# Altium project SynTrack.PrjPcb
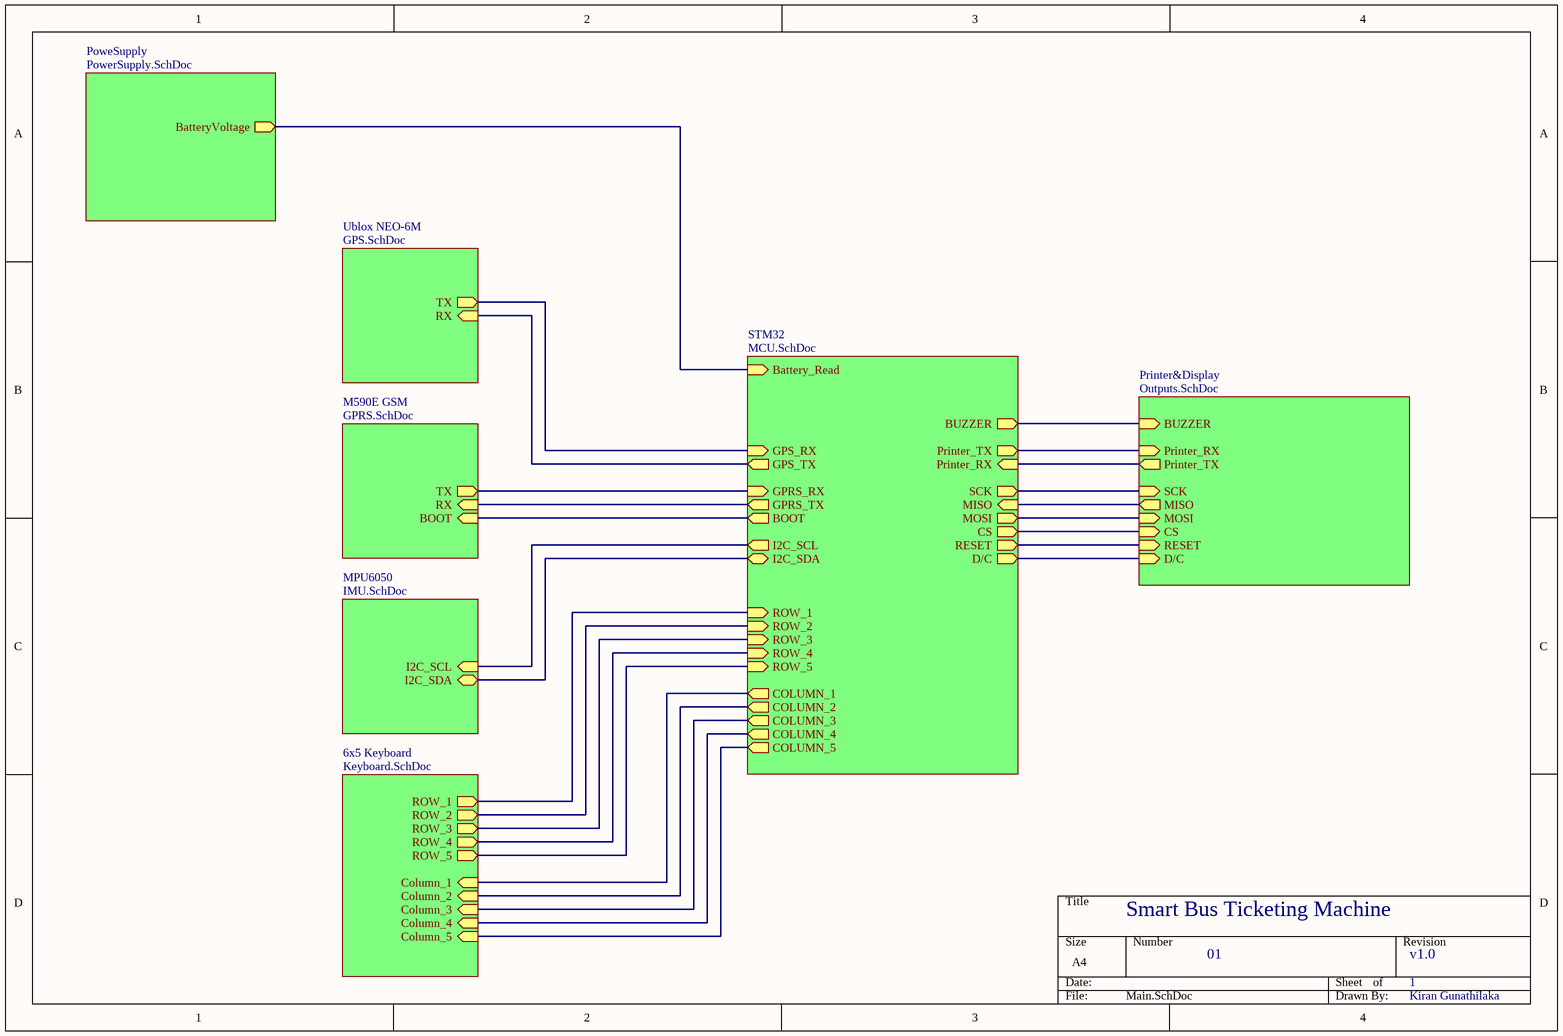
[diagram p0: Main.SchDoc]
11 sheets, 123 parts. Net scope: hierarchical (ports join the sheet entries above them; power ports are global).
Board file: Main.PcbDoc
Sheets:
  Main.SchDoc
    STM32 = MCU.SchDoc
    M590E GSM = GPRS.SchDoc
    MPU6050 = IMU.SchDoc
    6x5 Keyboard = Keyboard.SchDoc
    Ublox NEO-6M = GPS.SchDoc
    PoweSupply = PowerSupply.SchDoc
    Printer&Display = Outputs.SchDoc
      Buzzer = Buzzer.SchDoc
      ThermalPrinter = Printer.SchDoc
      TFT_LCD_2.8" Display = Display.SchDoc

## Sheet Main.SchDoc: Smart Bus Ticketing Machine
size A4; Date: 3/10/2025; ApprovedBy: Kiran Gunathilaka; CheckedBy: Kiran Gunathilaka; Author: Kiran Gunathilaka; DrawnBy: Kiran Gunathilaka; DocumentNumber: 01; Revision: v1.0; SheetNumber: 1; SheetTotal: 11

### Sub-sheets
6x5 Keyboard = Keyboard.SchDoc: ROW_1 (out), ROW_2 (out), ROW_3 (out), ROW_4 (out), ROW_5 (out), Column_1 (in), Column_2 (in), Column_3 (in), Column_4 (in), Column_5 (in)
M590E GSM = GPRS.SchDoc: RX (in), TX (out), BOOT (in)
MPU6050 = IMU.SchDoc: I2C_SCL (in), I2C_SDA (bidir)
PoweSupply = PowerSupply.SchDoc: BatteryVoltage (out)
Printer&Display = Outputs.SchDoc: BUZZER (in), Printer_TX (out), Printer_RX (in), SCK (in), MISO (out), MOSI (in), CS (in), RESET (in), D/C (in)
STM32 = MCU.SchDoc: Printer_TX (out), Printer_RX (in), GPS_RX (in), GPS_TX (out), GPRS_RX (in), GPRS_TX (out), BUZZER (out), Battery_Read (in), ROW_1 (in), ROW_2 (in), ROW_3 (in), ROW_4 (in), ROW_5 (in), SCK (out), MISO (in), MOSI (out), COLUMN_1 (out), COLUMN_2 (out), COLUMN_3 (out), COLUMN_4 (out), COLUMN_5 (out), CS (out), I2C_SCL (out), I2C_SDA (bidir), RESET (out), D/C (out), BOOT (out)
Ublox NEO-6M = GPS.SchDoc: RX (in), TX (out)

### Nets
ADC_OUT: sheet STM32/Battery_Read, sheet PoweSupply/BatteryVoltage
BOOT: sheet STM32/BOOT, sheet M590E GSM/BOOT
Buzzer: sheet STM32/BUZZER, sheet Printer&Display/BUZZER
CS: sheet STM32/CS, sheet Printer&Display/CS
D/C: sheet STM32/RESET, sheet Printer&Display/RESET
GPRS_RX: sheet STM32/GPRS_RX, sheet M590E GSM/TX
GPRS_TX: sheet STM32/GPRS_TX, sheet M590E GSM/RX
GPS_RX: sheet STM32/GPS_RX, sheet Ublox NEO-6M/TX
GPS_TX: sheet STM32/GPS_TX, sheet Ublox NEO-6M/RX
MISO: sheet STM32/MISO, sheet Printer&Display/MISO
MOSI: sheet STM32/MOSI, sheet Printer&Display/MOSI
Printer_RX: sheet STM32/Printer_RX, sheet Printer&Display/Printer_TX
Printer_TX: sheet STM32/Printer_TX, sheet Printer&Display/Printer_RX
RESET: sheet STM32/D/C, sheet Printer&Display/D/C
ROW1: sheet STM32/ROW_1, sheet 6x5 Keyboard/ROW_1
ROW2: sheet STM32/ROW_2, sheet 6x5 Keyboard/ROW_2
ROW3: sheet STM32/ROW_3, sheet 6x5 Keyboard/ROW_3
ROW4: sheet STM32/ROW_4, sheet 6x5 Keyboard/ROW_4
ROW5: sheet STM32/ROW_5, sheet 6x5 Keyboard/ROW_5
SCK: sheet STM32/SCK, sheet Printer&Display/SCK
NetD4_1: sheet STM32/COLUMN_1, sheet 6x5 Keyboard/Column_1
NetD5_1: sheet STM32/COLUMN_2, sheet 6x5 Keyboard/Column_2
NetD6_1: sheet STM32/COLUMN_3, sheet 6x5 Keyboard/Column_3
NetD7_1: sheet STM32/COLUMN_4, sheet 6x5 Keyboard/Column_4
NetD8_1: sheet STM32/COLUMN_5, sheet 6x5 Keyboard/Column_5
NetR8_2: sheet STM32/I2C_SCL, sheet MPU6050/I2C_SCL
NetR9_2: sheet STM32/I2C_SDA, sheet MPU6050/I2C_SDA

## Sheet MCU.SchDoc: Smart Bus Ticketing Machine/MCU
size A4; Date: 3/10/2025; CheckedBy: Kiran Gunathilaka; Author: Kiran Gunathilaka; DrawnBy: Kiran Gunathilaka; DocumentNumber: 02; Revision: v1.1; SheetNumber: 2; SheetTotal: 11
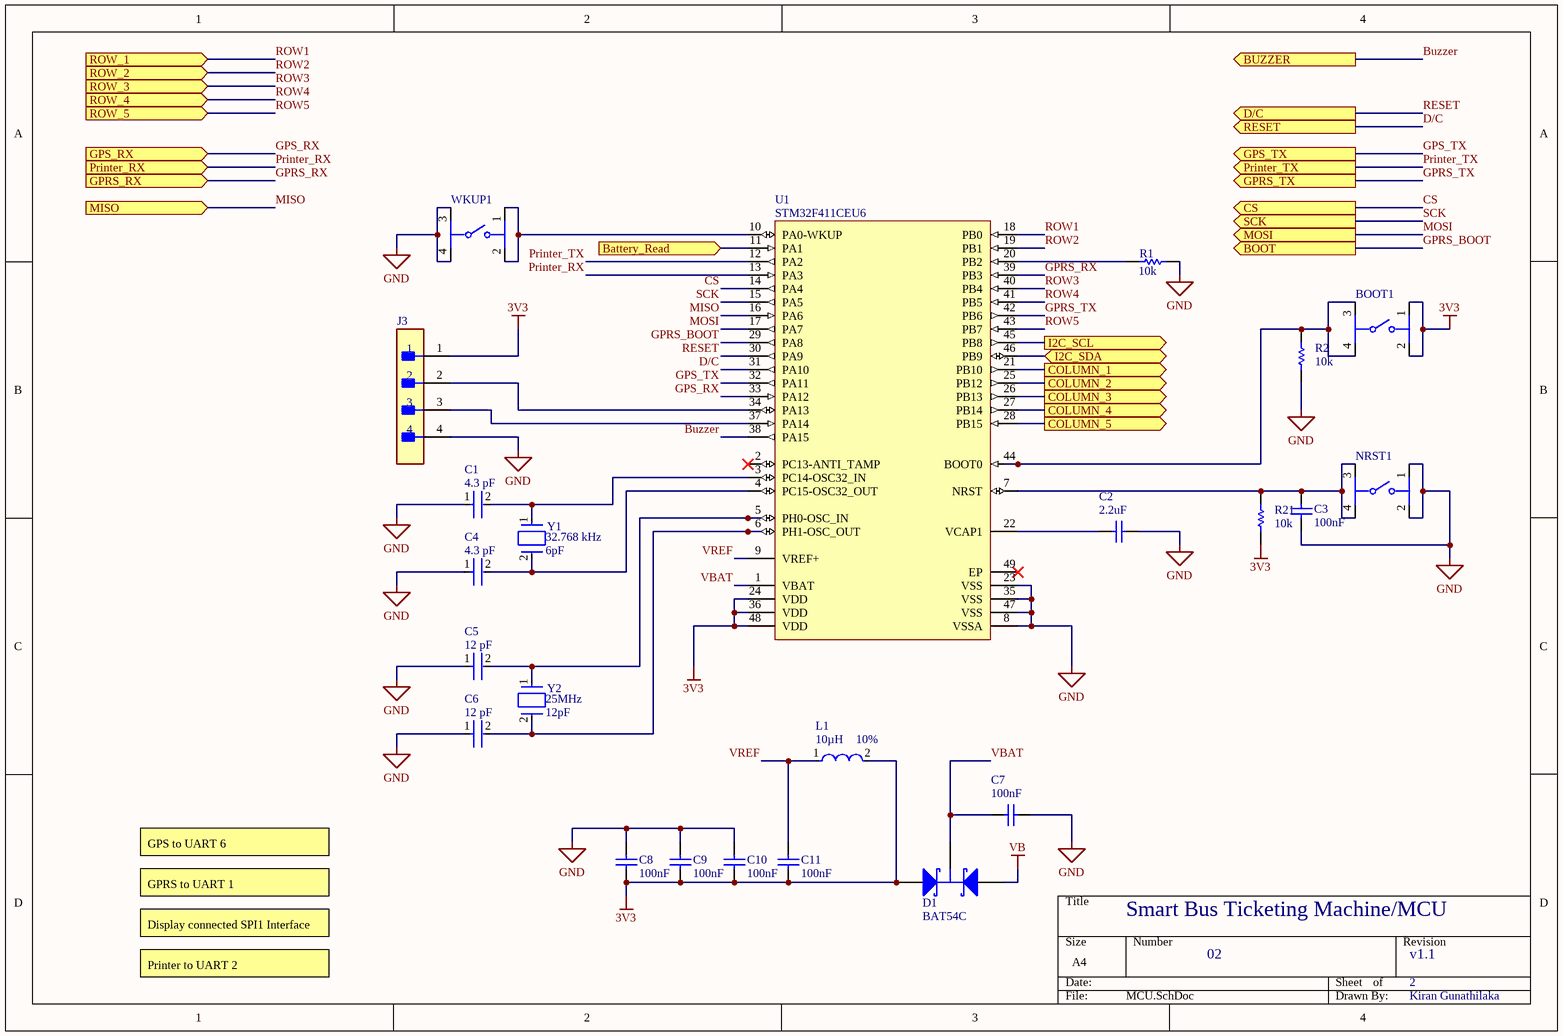
[diagram p1: MCU.SchDoc]

### Parts
BOOT1  PTS645SM43SMTR92LFS  [FP-PTS645SM43SMTR92LFS-MFG]  (value not drawn)
C1  Capacitance: 4.3 pF  [FP-C0805C-DN-MFG]  (hidden comment: C0805C439C5GACTU)
C2  value 2.2uF  [CAPC2013X145X50ML20T25]  (hidden comment: C0805C225K9PACTU)
C3  value 100nF  [CAPC2013X94X50ML20T25]  (hidden comment: 08051C152KAT2A)
C4  Capacitance: 4.3 pF  [FP-C0805C-DN-MFG]  (hidden comment: C0805C439C5GACTU)
C5  Capacitance: 12 pF  [FP-C0805C-DN-MFG]  (hidden comment: C0805C120J5GACTU)
C6  Capacitance: 12 pF  [FP-C0805C-DN-MFG]  (hidden comment: C0805C120J5GACTU)
C7  value 100nF  [CAPC2013X94X50ML20T25]  (hidden comment: 08051C152KAT2A)
C8  value 100nF  [CAPC2013X94X50ML20T25]  (hidden comment: 08051C152KAT2A)
C9  value 100nF  [CAPC2013X94X50ML20T25]  (hidden comment: 08051C152KAT2A)
C10  value 100nF  [CAPC2013X94X50ML20T25]  (hidden comment: 08051C152KAT2A)
C11  value 100nF  [CAPC2013X94X50ML20T25]  (hidden comment: 08051C152KAT2A)
D1  BAT54C  [NXP-SOT23-3_V]
J3  B04B-XASK-1(LF)(SN)  [FP-B04B-XASK-1_LF_SN-MFG]  (value not drawn)
L1  Inductance: 10µH  Tolerance: 10%  [FP-IMC-1210-MFG]  (hidden comment: IMC1210ER100K)
NRST1  PTS645SM43SMTR92LFS  [FP-PTS645SM43SMTR92LFS-MFG]  (value not drawn)
R1  value 10k  [RESC2013X60X35NL10T20]  (hidden comment: RC0805FR-0710KL)
R2  value 10k  [RESC2013X60X35NL10T20]  (hidden comment: RC0805FR-0710KL)
R21  value 10k  [RESC2013X60X35NL10T20]  (hidden comment: RC0805FR-0710KL)
U1  STM32F411CEU6  [STM-UFQFPN48_L]
WKUP1  PTS645SM43SMTR92LFS  [FP-PTS645SM43SMTR92LFS-MFG]  (value not drawn)
Y1  Load Capacitance: 6pF  Operating Frequency: 32.768 kHz  [FP-ABS07-120-MFG]  (hidden comment: ABS07-120-32.768KHZ-T)
Y2  Frequency: 25MHz  Load Capacitance: 12pF  [FP-AA-MFG]  (hidden comment: AA-25.000MALE-T)

### Ports
Battery_Read (in, see Main[2B]), BOOT (out, see Main[2C], GPRS[1A]), BUZZER (out, see Main[3B], Buzzer[2B], Outputs[2B]), COLUMN_1 (out, see Main[2C], Keyboard[1A]), COLUMN_2 (out, see Main[2C], Keyboard[1A]), COLUMN_3 (out, see Main[2C], Keyboard[1A]), COLUMN_4 (out, see Main[2C], Keyboard[1A]), COLUMN_5 (out, see Main[2C], Keyboard[1A]), CS (out, see Main[3C], Display[2C], Outputs[2C]), D/C (out, see Main[3C], Display[2C], Outputs[2D]), GPRS_RX (in, see Main[2B]), GPRS_TX (out, see Main[2B]), GPS_RX (in, see Main[2B]), GPS_TX (out, see Main[2B]), I2C_SCL (out, see Main[2C], IMU[2B]), I2C_SDA (bidir, see Main[2C], IMU[2B]), MISO (in, see Main[3B], Display[3B], Outputs[4C]), MOSI (out, see Main[3C], Display[2C], Outputs[2D]), Printer_RX (in, see Main[3B]), Printer_TX (out, see Main[3B]), RESET (out, see Main[3C], Display[2C], Outputs[2D]), ROW_1 (in, see Main[2C], Keyboard[3B]), ROW_2 (in, see Main[2C], Keyboard[3B]), ROW_3 (in, see Main[2C], Keyboard[3C]), ROW_4 (in, see Main[2C], Keyboard[3C]), ROW_5 (in, see Main[2C], Keyboard[3D]), SCK (out, see Main[3B], Display[2C], Outputs[2C])

### Nets
3V3: BOOT1.1 BOOT1.2 C8.1 C9.1 C10.1 C11.1 D1.1(A) J3.1 L1.2 R21.1 U1.24(VDD) U1.36(VDD) U1.48(VDD)
GND: C1.1 C2.2 C3.1 C4.1 C5.1 C6.1 C7.2 C8.2 C9.2 C10.2 J3.4 NRST1.1 NRST1.2 R1.1 R2.1 U1.8(VSSA) U1.23(VSS) U1.35(VSS) U1.47(VSS) WKUP1.3 WKUP1.4
VB: D1.2(A)
ADC_OUT: U1.11(PA1) ; port Battery_Read
Buzzer: U1.38(PA15) ; port BUZZER
CS: U1.14(PA4) ; port CS
D/C: U1.31(PA10) ; port RESET
GPRS_BOOT: U1.29(PA8) ; port BOOT  [project net BOOT]
GPRS_RX: U1.39(PB3) ; port GPRS_RX
GPRS_TX: U1.42(PB6) ; port GPRS_TX
GPS_RX: U1.33(PA12) ; port GPS_RX
GPS_TX: U1.32(PA11) ; port GPS_TX
MISO: U1.16(PA6) ; port MISO
MOSI: U1.17(PA7) ; port MOSI
Printer_RX: U1.13(PA3) ; port Printer_RX
Printer_TX: U1.12(PA2) ; port Printer_TX
RESET: U1.30(PA9) ; port D/C
ROW1: U1.18(PB0) ; port ROW_1
ROW2: U1.19(PB1) ; port ROW_2
ROW3: U1.40(PB4) ; port ROW_3
ROW4: U1.41(PB5) ; port ROW_4
ROW5: U1.43(PB7) ; port ROW_5
SCK: U1.15(PA5) ; port SCK
VBAT: C7.1 D1.3(K) U1.1(VBAT)
VREF: C11.2 L1.1 U1.9(VREF+)
NetBOOT1_3: BOOT1.3 BOOT1.4 R2.2 U1.44(BOOT0)
NetC1_2: C1.2 U1.3(PC14-OSC32_IN) Y1.1
NetC2_1: C2.1 U1.22(VCAP1)
NetC3_2: C3.2 NRST1.3 NRST1.4 R21.2 U1.7(NRST)
NetC4_2: C4.2 U1.4(PC15-OSC32_OUT) Y1.2
NetC5_2: C5.2 U1.5(PH0-OSC_IN) Y2.1
NetC6_2: C6.2 U1.6(PH1-OSC_OUT) Y2.2
NetD4_1: U1.21(PB10) ; port COLUMN_1
NetD5_1: U1.25(PB12) ; port COLUMN_2
NetD6_1: U1.26(PB13) ; port COLUMN_3
NetD7_1: U1.27(PB14) ; port COLUMN_4
NetD8_1: U1.28(PB15) ; port COLUMN_5
NetJ3_2: J3.2 U1.34(PA13)
NetJ3_3: J3.3 U1.37(PA14)
NetR1_2: R1.2 U1.20(PB2)
NetR8_2: U1.45(PB8) ; port I2C_SCL
NetR9_2: U1.46(PB9) ; port I2C_SDA
NetU1_10: U1.10(PA0-WKUP) WKUP1.1 WKUP1.2

Not connected (* = marked no-connect by the designer): U1 2(PC13-ANTI_TAMP)* 49(EP)*

### Notes on the sheet
- GPS to UART 6
- GPRS to UART 1
- Display connected SPI1 Interface
- Printer to UART 2

### Library data of the parts
BOOT1 NRST1 WKUP1 = CMP-2000-05160-2: SWITCH TACTILE SPST-NO 0.05A 12V; Contact Resistance: 100mR; Throw Configuration: SPST; Illumination Type: Non-Illuminated; Mechanical Life: 100000Cycles; Current Rating: 50mA; Switch Function: Off-Mom; Actuator Length: 0.85mm; Actuator Material: Nylon; Actuator Type: Standard; Operating Force: 160gf; Min Operating Temperature: -20°C; REACH SVHC: No SVHC; Termination: Gull Wing; Case/Package: SMD/SMT; Packaging: Tape and Reel; Mount: Surface Mount; Voltage Rating (DC): 12V; Orientation: Straight; Lead Free: Lead Free; Contact Material: Silver; Color: Black; Max Current Rating: 50mA; Contact Plating: Silver; Depth: 9mm; Package Quantity: 1; Max Voltage Rating (DC): 12V; Length: 6mm; Max Operating Temperature: 60°C
C1 C4 = CMP-03020-016664-1: CAP CER 4.3PF 50V NP0 0805; Manufacturer: KEMET; Tolerance: 0.25 pF; Temperature Characteristic: C0G; Temperature Coefficient: 30ppm/°C; Material: Ceramic; Octopart: https://octopart.com/c0805c439c5gactu-kemet-9144293; Automotive: No; Height: 0.88mm; Device Class L1: Passive Components; ComponentLink2URL: https://content.kemet.com/datasheets/KEM_C1003_C0G_SMD.pdf; RoHS: TRUE; Temperature Range Low: -55°C; Temperature Range High: +125°C; Mouser Description: Multilayer Ceramic Capacitors MLCC - SMD/SMT 50volts 4.3pF C0G 0.25%; Digikey Description: CAP CER 4.3PF 50V NP0 0805; Temperature: -55°C to +125°C; Ipc Land Pattern Name: CAPC200125X78; Value: 4.3 pF; Device Class L2: Capacitors; Device Class L3: Ceramic Capacitors; Package: C0805C-DN; Voltage Rating: 50 V; ComponentLink2Description: Datasheet; Lead Free: Yes; Category: Cap; Manufacturer Part Number: C0805C439C5GACTU
C2 = CMP-1036-04819-2: Manufacturer: Kemet; Part Number: C0805C225K9PACTU
C3 C7-C11 = CMP-2007-04179-1: Manufacturer: AVX Interconnect / Elco; Part Number: 08051C152KAT2A
C5 C6 = CMP-2007-00441-2: CAP CER 12PF 50V C0G/NP0 0805; Manufacturer: KEMET; Temperature Characteristic: C0G; Temperature Coefficient: 30ppm/°C; Material: Ceramic; Tolerance: 0.05; Height: 0.88mm; ComponentLink2URL: https://content.kemet.com/datasheets/KEM_C1003_C0G_SMD.pdf; Automotive: No; Device Class L2: Capacitors; Digikey Description: CAP CER 12PF 50V C0G/NP0 0805; Value: 12 pF; Device Class L3: Ceramic Capacitors; Voltage Rating: 50 V; Mouser Description: Multilayer Ceramic Capacitors MLCC - SMD/SMT 50volts 12pF C0G 5%; Device Class L1: Passive Components; ComponentLink2Description: Datasheet; RoHS: TRUE; Temperature Range High: +125°C; Lead Free: Yes; Category: Cap; Ipc Land Pattern Name: CAPC200125X78; Package: C0805C-DN; Manufacturer Part Number: C0805C120J5GACTU; Octopart: https://octopart.com/c0805c120j5gactu-kemet-126518; Temperature Range Low: -55°C; Temperature: -55°C to +125°C
D1 = CMP-0417-00003-1: Schottky Barrier Diode, 30 V, 2 uA, -55 to 150 degC, 3-Pin SOT23, RoHS, Tape and Reel; Manufacturer: NXP Semiconductors; IR (uA): 2; VF (mV): 800; Trr (ns): 5; Cd (pF): 10; VR (V): 30; Rth(j-a) (K/W): 500; RoHS: TRUE; Packing: Tape and Reel; ComponentLink2URL: http://www.nxp.com/documents/data_sheet/BAT54_SER.pdf; PartNumber: BAT54C; ComponentLink2Description: Datasheet; Temperature Range: -55 to 150 degC; PackageReference: SOT23-3; PackageDescription: 3-Pin Plastic Surface-mounted Package, Body 1.3 x 2.9 mm, Pitch 0.95 mm; Mounting Technology: Surface Mount; ComponentLink1URL: http://www.nxp.com/; DatasheetVersion: Rev. 5; ComponentLink1Description: Manufacturer URL
J3 = CMP-17439-000018-1: CONN HEADER VERT 4POS 2.5MM; Manufacturer: JST; Current Rating: 3A; Voltage Rating: 250V; Conn Orientation: Straight; Conn Gender: Male; Number Of Contacts: 4; ComponentLink2Description: Datasheet; Package: B04B-XASK-1(LF)(SN); Octopart: https://octopart.com/b04b-xask-1%28lf%29%28sn%29-jst-3990149; Pitch: 2.5mm; Device Class L1: Connectors; RoHS: TRUE; Device Class L3: unset; Manufacturer Part Number: B04B-XASK-1(LF)(SN); Temperature Range High: +85°C; Height: 8.8mm; Lead Free: Yes; Category: Conn; Temperature: -25°C to +85°C; Digikey Description: CONN HEADER VERT 4POS 2.5MM; Temperature Range Low: -25°C; ComponentLink2URL: http://www.jst-mfg.com/product/pdf/eng/eXA1.pdf; Contact Material: Tin,Copper; Device Class L2: Headers and Wire Housings; Automotive: No; Number Of Rows: 1
L1 = CMP-00030-39678477-1: IMC1210ER100K Inductor Chip Molded Wirewound 10uH 10% 2.52MHz 30Q-Factor Powdered Iron 189mA 2.1Ohm DCR 1210 T/R; Self Resonant Frequency: 33MHz; Core Material: Ceramic, Ferrite; DC Resistance (DCR): 2.1Ω; Current: 290mA; Q Factor: 30; Shielding: Unshielded; Depth: 2.69mm; Termination: SMD/SMT; Test Frequency: 2.52MHz; DC Current: 189mA; Packaging: Cut Tape; Case Code (Metric): 3225; Case/Package: 1210; Length: 3.2004mm; Current Rating: 189mA; Lead Free: Lead Free; Weight: 15.989131mg; Width: 2.49mm; Mount: Surface Mount; Max DC Current: 189mA; Composition: Wirewound; RoHS: Compliant; Case Code (Imperial): 1210; Height: 2.21mm; Min Operating Temperature: -55°C; Radiation Hardening: No; Military Standard: Not; Inductance Tolerance: 10%; Max Operating Temperature: 125°C; Schedule B: 8504500000, 8504500000; REACH SVHC: Unknown; Height - Seated (Max): 2.413mm; Number of Pins: 2; NexarPartId: 39678477
R1 R2 R21 = CMP-1659-00013-4: Chip Resistor, 10 KOhm, +/- 1%, 0.125 W, -55 to 155 degC, 0805 (2012 Metric), RoHS, Tape and Reel; Manufacturer: Yageo; Voltage Rating: 150 V; Mount: Surface Mount; ComponentLink1Description: Manufacturer URL; ComponentLink2URL: http://www.yageo.com/documents/recent/PYu-RC_Group_51_RoHS_L_04.pdf; Pins: 2; Length: 2 mm; Min Operating Temperature: -55 degC; Height: 0.5 mm; Mounting Technology: Surface Mount; RoHSCompliant: true; REACH SVHC: No SVHC; ComponentLink1URL: http://www.yageo.com/; Max Operating Temperature: 155 degC; PackageReference: 0805; DatasheetVersion: Rev. 4, 02/2016; Package Quantity: 5000; Packaging: Tape and Reel; ComponentLink2Description: Datasheet; PackageDescription: 2-Pin Surface Mounted Device, Body 2 x 1.25 mm
U1 = CMP-0243-00165-1: ARM Cortex-M4 32-bit MCU+FPU, 512 KB Flash, 128 KB RAM, 36 I/Os, 48-Pin UFQFPN, -40 to 85 degC, Tray; Operating Frequency(F) (Processor speed) (MHz): 100; FLASH Size (Prog) (kB): 512; Internal RAM Size (kB): 128; I/Os (High Current): 36; Supply Voltage(Vcc) min (V): 1.7; Package Reference: 48-Pin Ultra Thin Fine Pitch Quad Flat No-Lead, 7 x 7 x 0.6 mm Body, 0.5 mm Pitch, Exposed Pad; ComponentLink1Description: Manufacturer URL; ComponentLink1URL: http://www.st.com/; Packing: Tray; Package Description: UFQFPN48; Core: ARM Cortex-M4; ComponentLink2Description: Datasheet; ComponentLink2URL: http://www.st.com/st-web-ui/static/active/en/resource/technical/document/datasheet/DM00115249.pdf; DatasheetVersion: Rev. 6; Mounting Technology: Surface Mount
Y1 = CMP-2000-07587-2: CRYSTAL 32.7680KHZ 6PF SMD; Frequency Tolerance: 20ppm; Series Resistance: 60kR; ESR (Equivalent Series Resistance): 55kR; Depth: 1.5mm; Width: 0.061inch; Number of Pins: 2; Max Operating Temperature: 85°C; Length: 3.2mm; Case/Package: SMD/SMT; Series: ABS07; Lead Free: Lead Free; Min Operating Temperature: -40°C; Packaging: Tape and Reel; Height: 0.035inch; Radiation Hardening: No; Tolerance: 20ppm; Termination: SMD/SMT; REACH SVHC: No SVHC; RoHS Compliant: Yes; Frequency: 32.768kHz; Package Quantity: 3000; Mount: Surface Mount
Y2 = CMP-18717-000190-1: CRYSTAL 25.0000MHZ 12PF SMD; Tolerance: 30ppm; Frequency Stability: 150ppm; ESR (Equivalent Series Resistance): 50R; Frequency Tolerance: 30ppm; Number of Pins: 2; Series: AA; Min Operating Temperature: -40°C; REACH SVHC: No SVHC; Length: 0.197inch; Package Quantity: 1000; Packaging: Tape and Reel; Termination: SMD/SMT; Case/Package: SMD/SMT; Max Operating Temperature: 125°C; Ratings: AEC-Q200; Height: 0.053inch; Width: 0.126inch; Mount: Surface Mount

## Sheet GPRS.SchDoc: Smart Bus Ticketing Machine/GPRS
size A4; Date: 3/10/2025; ApprovedBy: Kiran Gunathilaka; CheckedBy: Kiran Gunathilaka; Author: Kiran Gunathilaka; DrawnBy: Kiran Gunathilaka; DocumentNumber: 03; Revision: v1.1; SheetNumber: 6; SheetTotal: 11
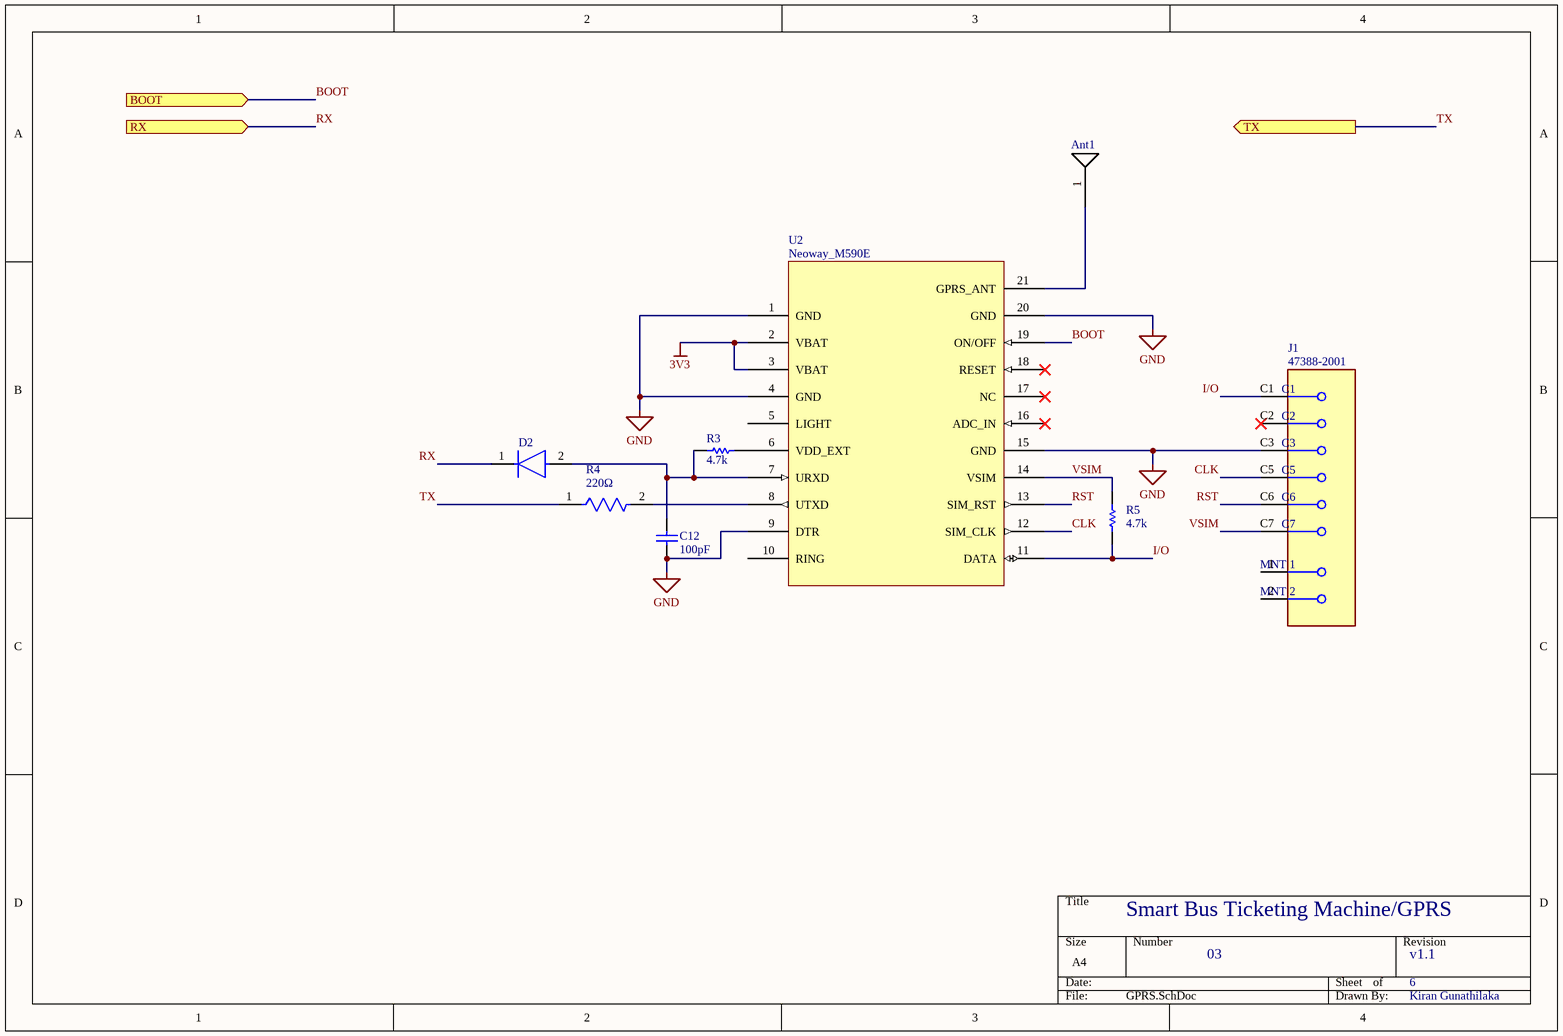
[diagram p2: GPRS.SchDoc]

### Parts
Ant1  (no value)  [Antenna]
C12  value 100pF  [CAPC2013X94X50ML20T25]  (hidden comment: 08051C152KAT2A)
D2  TS4148 RYG  [FP-TS4148_RYG-MFG]  (value not drawn)
J1  47388-2001  [FP-47388-2001-MFG]
R3  value 4.7k  [RESC2013X60X40ML20T25]  (hidden comment: ERA6AEB472V)
R4  value 220Ω  [FP-CRGCQ0805-IPC_C]  (hidden comment: CRGCQ0805F22R)
R5  value 4.7k  [RESC2013X60X40ML20T25]  (hidden comment: ERA6AEB472V)
U2  Neoway_M590E  [Neoway-M590E]

### Ports
BOOT (in, see Main[2C], MCU[4A]), RX (in, see Main[2B]), TX (out, see Main[2B])

### Nets
3V3: U2.2(VBAT) U2.3(VBAT)
GND: C12.1 J1.C3 U2.1(GND) U2.4(GND) U2.9(DTR) U2.15(GND) U2.20(GND)
BOOT: U2.19(ON/OFF) ; port BOOT
CLK: J1.C5 U2.12(SIM_CLK)
I/O: J1.C1 R5.1 U2.11(DATA)
RST: J1.C6 U2.13(SIM_RST)
RX: D2.1(C) ; port RX  [project net GPRS_TX]
TX: R4.1 ; port TX  [project net GPRS_RX]
VSIM: J1.C7 R5.2 U2.14(VSIM)
NetAnt1_1: Ant1.1 U2.21(GPRS_ANT)
NetC12_2: C12.2 D2.2(A) R3.2 U2.7(URXD)
NetR3_1: R3.1 U2.6(VDD_EXT)
NetR4_2: R4.2 U2.8(UTXD)

Not connected (* = marked no-connect by the designer): J1 1(MNT_1) 2(MNT_2) C2*; U2 5(LIGHT) 10(RING) 16(ADC_IN)* 17(NC)* 18(RESET)*

### Library data of the parts
Ant1 = Antenna
C12 = CMP-2007-04179-1: Manufacturer: AVX Interconnect / Elco; Part Number: 08051C152KAT2A
D2 = CMP-15605-000006-1: Rectifier Diode Switching 75V 0.15A 4ns 2-Pin Case 0805(2012Metric) T/R; Peak Non-Repetitive Surge Current: 2A; Element Configuration: Single; Forward Voltage: 1V; Max Operating Temperature: 175°C; Packaging: Tape and Reel; Radiation Hardening: No; Min Operating Temperature: -65°C; Reverse Recovery Time: 4ns; Mount: Surface Mount; RoHS Compliant: Yes; Max Forward Surge Current (Ifsm): 2A; Case/Package: SMD/SMT; Number of Pins: 2; Max Repetitive Reverse Voltage (Vrrm): 75V
J1 = CMP-04763-000009-1: CONN SIM CARD HINGED TYPE R/A; Pitch: 2.54mm; Number of Circuits: 478; Current Rating: 500mA; Gender: Female; Voltage Rating: 5V; Row Spacing: 16.8mm; Number of Contacts: 6; Connector Type: Socket; Termination: SMD/SMT; Mount: Surface Mount; Contact Plating: Gold; Orientation: Horizontal; Series: 47388; Packaging: Tape and Reel; Number of Rows: 1; Min Operating Temperature: -40°C; Max Operating Temperature: 85°C; RoHS Compliant: Yes; Housing Material: Thermoplastic; Contact Material: Bronze
R3 R5 = CMP-2001-00644-1: Manufacturer: Panasonic; Part Number: ERA6AEB472V
R4 = CMP-03211-006853-1: CRGCQ 0805 22R 1%; Manufacturer: TE Connectivity; Voltage Rating: 150V; Tolerance: 0.01; Power Rating: 0.125W; Resistance: 22Ω; Automotive Grade: Grade 301; Temperature Coefficient: ±200ppm/°C; Temperature: -55°C to +155°C; Digikey Description: CRGCQ 0805 22R 1%; Ipc Land Pattern Name: RESC200125X55; Temperature Range Low: -55°C; ComponentLink2URL: https://www.te.com/commerce/DocumentDelivery/DDEController?Action=showdoc&DocId=Data+Sheet%7F1773204-3%7F1%7Fpdf%7FEnglish%7FENG_DS_1773204-3_1.pdf%7F4-2176341-310; Package: CRGCQ0805; Octopart: https://octopart.com/crgcq0805f22r-te+connectivity-91018162; Height: 0.65mm; Ambient Temperature Range High: +70°C; Manufacturer Part Number: CRGCQ0805F22R; Device Class L2: Resistors; Composition: Thick Film; Temperature Range High: +155°C; Device Class L3: Chip SMD Resistors; RoHS: TRUE; Lead Free: Yes; Mouser Description: SMD AEC-Q200 Compliant Thick Film Chip Resistor; Device Class L1: Passive Components; ComponentLink2Description: Datasheet; Series: CRGCQ; Category: Res; Automotive: Yes

## Sheet IMU.SchDoc: Smart Bus Ticketing Machine/IMU
size A4; Date: 3/10/2025; ApprovedBy: Kiran Gunathilaka; CheckedBy: Kiran Gunathilaka; Author: Kiran Gunathilaka; DrawnBy: Kiran Gunathilaka; DocumentNumber: 05; Revision: v1.1; SheetNumber: 4; SheetTotal: 11
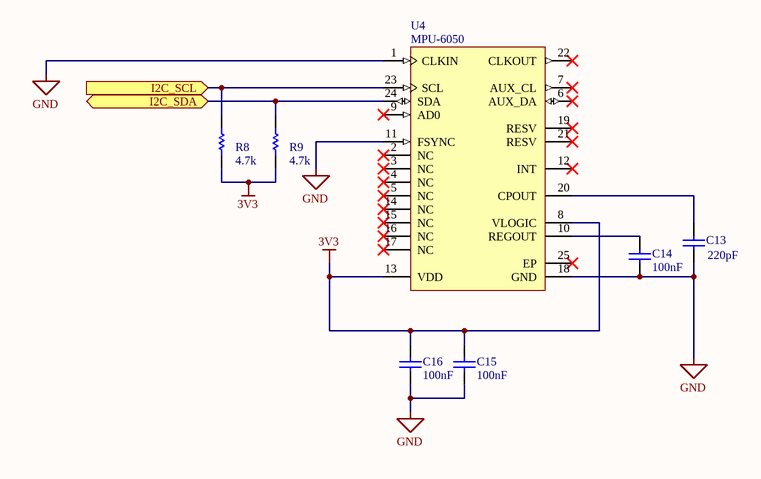
[diagram p3: IMU.SchDoc]

### Parts
C13  value 220pF  [CAPC2013X88X50ML20T25]  (hidden comment: C0805C221J5GACTU)
C14  value 100nF  [CAPC2013X94X50ML20T25]  (hidden comment: 08051C152KAT2A)
C15  value 100nF  [CAPC2013X94X50ML20T25]  (hidden comment: 08051C152KAT2A)
C16  value 100nF  [CAPC2013X94X50ML20T25]  (hidden comment: 08051C152KAT2A)
R8  value 4.7k  [RESC2013X60X40ML20T25]  (hidden comment: ERA6AEB472V)
R9  value 4.7k  [RESC2013X60X40ML20T25]  (hidden comment: ERA6AEB472V)
U4  MPU-6050  [IS-QFN-24_V]

### Ports
I2C_SCL (in, see Main[2C], MCU[3B]), I2C_SDA (bidir, see Main[2C], MCU[3B])

### Nets
3V3: C15.2 C16.2 R8.1 R9.1 U4.8(VLOGIC) U4.13(VDD)
GND: C13.1 C14.1 C15.1 C16.1 U4.1(CLKIN) U4.11(FSYNC) U4.18(GND)
NetC13_2: C13.2 U4.20(CPOUT)
NetC14_2: C14.2 U4.10(REGOUT)
NetR8_2: R8.2 U4.23(SCL) ; port I2C_SCL
NetR9_2: R9.2 U4.24(SDA) ; port I2C_SDA

Not connected (* = marked no-connect by the designer): U4 2(NC)* 3(NC)* 4(NC)* 5(NC)* 6(AUX_DA)* 7(AUX_CL)* 9(AD0)* 12(INT)* 14(NC)* 15(NC)* 16(NC)* 17(NC)* 19(RESV)* 21(RESV)* 22(CLKOUT)* 25(EP)*

### Library data of the parts
C13 = CMP-2007-00316-1: Manufacturer: Kemet; Part Number: C0805C221J5GACTU
C14-C16 = CMP-2007-04179-1: Manufacturer: AVX Interconnect / Elco; Part Number: 08051C152KAT2A
R8 R9 = CMP-2001-00644-1: Manufacturer: Panasonic; Part Number: ERA6AEB472V
U4 = CMP-1753-00002-2: 3-Axis Gyroscope, Accelerometer and a Digital Motion Processor(TM) (DMP), 2.375 to 3.46 V, -40 to 85 degC, 24-Pin QFN, RoHS, Tape and Reel; Manufacturer: InvenSense; Featured Product: MPU-60506-Axis,IntegratedI²CSolution; Other Names: 1428-1007-2 / MPU6050; Sensor Type: MotionTracking; Online Catalog: MPU-6000™Series; Unit PriceUSD: Digital; Datasheet Version: Rev. 3.3, 05/2012; Category: Sensors,Transducers; Datasheet URL: http://datasheet.octopart.com/MPU-6050-InvenSense-datasheet-14421344.pdf; Family: Multifunction; Standard Package: 5,000; Manufacturer URL: http://www.invensense.com/; Output Type: Digital; Dynamic Catalog: MPU-6000™Series

## Sheet Keyboard.SchDoc: Smart Bus Ticketing Machine/Keyboard
size A4; Date: 3/10/2025; ApprovedBy: Kiran Gunathilaka; CheckedBy: Kiran Gunathilaka; Author: Kiran Gunathilaka; DrawnBy: Kiran Gunathilaka; DocumentNumber: 06; Revision: v1.0; SheetNumber: 5; SheetTotal: 11
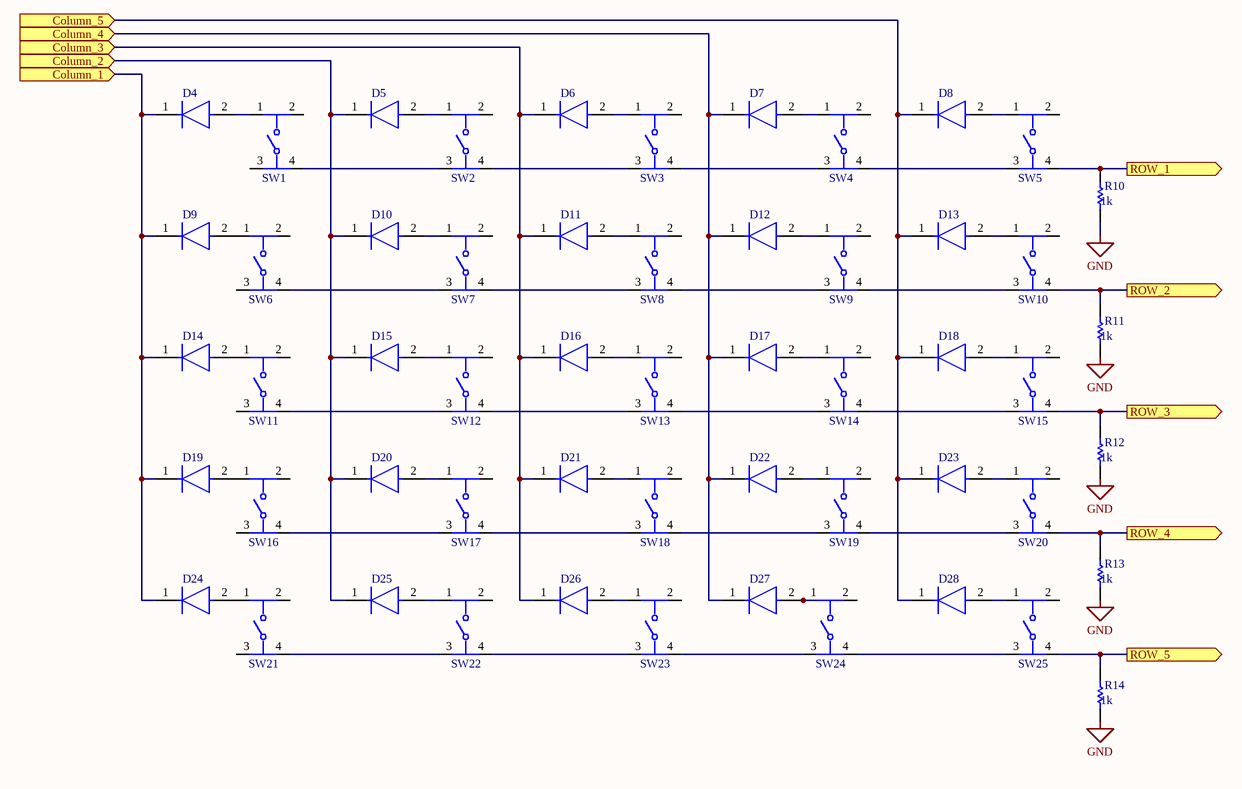
[diagram p4: Keyboard.SchDoc]

### Parts
D4  TS4148 RYG  [FP-TS4148_RYG-MFG]  (value not drawn)
D5  TS4148 RYG  [FP-TS4148_RYG-MFG]  (value not drawn)
D6  TS4148 RYG  [FP-TS4148_RYG-MFG]  (value not drawn)
D7  TS4148 RYG  [FP-TS4148_RYG-MFG]  (value not drawn)
D8  TS4148 RYG  [FP-TS4148_RYG-MFG]  (value not drawn)
D9  TS4148 RYG  [FP-TS4148_RYG-MFG]  (value not drawn)
D10  TS4148 RYG  [FP-TS4148_RYG-MFG]  (value not drawn)
D11  TS4148 RYG  [FP-TS4148_RYG-MFG]  (value not drawn)
D12  TS4148 RYG  [FP-TS4148_RYG-MFG]  (value not drawn)
D13  TS4148 RYG  [FP-TS4148_RYG-MFG]  (value not drawn)
D14  TS4148 RYG  [FP-TS4148_RYG-MFG]  (value not drawn)
D15  TS4148 RYG  [FP-TS4148_RYG-MFG]  (value not drawn)
D16  TS4148 RYG  [FP-TS4148_RYG-MFG]  (value not drawn)
D17  TS4148 RYG  [FP-TS4148_RYG-MFG]  (value not drawn)
D18  TS4148 RYG  [FP-TS4148_RYG-MFG]  (value not drawn)
D19  TS4148 RYG  [FP-TS4148_RYG-MFG]  (value not drawn)
D20  TS4148 RYG  [FP-TS4148_RYG-MFG]  (value not drawn)
D21  TS4148 RYG  [FP-TS4148_RYG-MFG]  (value not drawn)
D22  TS4148 RYG  [FP-TS4148_RYG-MFG]  (value not drawn)
D23  TS4148 RYG  [FP-TS4148_RYG-MFG]  (value not drawn)
D24  TS4148 RYG  [FP-TS4148_RYG-MFG]  (value not drawn)
D25  TS4148 RYG  [FP-TS4148_RYG-MFG]  (value not drawn)
D26  TS4148 RYG  [FP-TS4148_RYG-MFG]  (value not drawn)
D27  TS4148 RYG  [FP-TS4148_RYG-MFG]  (value not drawn)
D28  TS4148 RYG  [FP-TS4148_RYG-MFG]  (value not drawn)
R10  Resistance: 1k  [RESC2013X60X35ML10T20]  (hidden comment: RC0805FR-071KL)
R11  Resistance: 1k  [RESC2013X60X35ML10T20]  (hidden comment: RC0805FR-071KL)
R12  Resistance: 1k  [RESC2013X60X35ML10T20]  (hidden comment: RC0805FR-071KL)
R13  Resistance: 1k  [RESC2013X60X35ML10T20]  (hidden comment: RC0805FR-071KL)
R14  Resistance: 1k  [RESC2013X60X35ML10T20]  (hidden comment: RC0805FR-071KL)
SW1  PTS645SM43SMTR92LFS  [FP-PTS645SM43SMTR92LFS-MFG]  (value not drawn)
SW2  PTS645SM43SMTR92LFS  [FP-PTS645SM43SMTR92LFS-MFG]  (value not drawn)
SW3  PTS645SM43SMTR92LFS  [FP-PTS645SM43SMTR92LFS-MFG]  (value not drawn)
SW4  PTS645SM43SMTR92LFS  [FP-PTS645SM43SMTR92LFS-MFG]  (value not drawn)
SW5  PTS645SM43SMTR92LFS  [FP-PTS645SM43SMTR92LFS-MFG]  (value not drawn)
SW6  PTS645SM43SMTR92LFS  [FP-PTS645SM43SMTR92LFS-MFG]  (value not drawn)
SW7  PTS645SM43SMTR92LFS  [FP-PTS645SM43SMTR92LFS-MFG]  (value not drawn)
SW8  PTS645SM43SMTR92LFS  [FP-PTS645SM43SMTR92LFS-MFG]  (value not drawn)
SW9  PTS645SM43SMTR92LFS  [FP-PTS645SM43SMTR92LFS-MFG]  (value not drawn)
SW10  PTS645SM43SMTR92LFS  [FP-PTS645SM43SMTR92LFS-MFG]  (value not drawn)
SW11  PTS645SM43SMTR92LFS  [FP-PTS645SM43SMTR92LFS-MFG]  (value not drawn)
SW12  PTS645SM43SMTR92LFS  [FP-PTS645SM43SMTR92LFS-MFG]  (value not drawn)
SW13  PTS645SM43SMTR92LFS  [FP-PTS645SM43SMTR92LFS-MFG]  (value not drawn)
SW14  PTS645SM43SMTR92LFS  [FP-PTS645SM43SMTR92LFS-MFG]  (value not drawn)
SW15  PTS645SM43SMTR92LFS  [FP-PTS645SM43SMTR92LFS-MFG]  (value not drawn)
SW16  PTS645SM43SMTR92LFS  [FP-PTS645SM43SMTR92LFS-MFG]  (value not drawn)
SW17  PTS645SM43SMTR92LFS  [FP-PTS645SM43SMTR92LFS-MFG]  (value not drawn)
SW18  PTS645SM43SMTR92LFS  [FP-PTS645SM43SMTR92LFS-MFG]  (value not drawn)
SW19  PTS645SM43SMTR92LFS  [FP-PTS645SM43SMTR92LFS-MFG]  (value not drawn)
SW20  PTS645SM43SMTR92LFS  [FP-PTS645SM43SMTR92LFS-MFG]  (value not drawn)
SW21  PTS645SM43SMTR92LFS  [FP-PTS645SM43SMTR92LFS-MFG]  (value not drawn)
SW22  PTS645SM43SMTR92LFS  [FP-PTS645SM43SMTR92LFS-MFG]  (value not drawn)
SW23  PTS645SM43SMTR92LFS  [FP-PTS645SM43SMTR92LFS-MFG]  (value not drawn)
SW24  PTS645SM43SMTR92LFS  [FP-PTS645SM43SMTR92LFS-MFG]  (value not drawn)
SW25  PTS645SM43SMTR92LFS  [FP-PTS645SM43SMTR92LFS-MFG]  (value not drawn)

### Ports
Column_1 (in, see Main[2D], MCU[3B]), Column_2 (in, see Main[2D], MCU[3B]), Column_3 (in, see Main[2D], MCU[3B]), Column_4 (in, see Main[2D], MCU[3B]), Column_5 (in, see Main[2D], MCU[3B]), ROW_1 (out, see Main[2D], MCU[1A]), ROW_2 (out, see Main[2D], MCU[1A]), ROW_3 (out, see Main[2D], MCU[1A]), ROW_4 (out, see Main[2D], MCU[1A]), ROW_5 (out, see Main[2D], MCU[1A])

### Nets
GND: R10.1 R11.1 R12.1 R13.1 R14.1
ROW1: R10.2 SW5.4 ; port ROW_1
ROW2: R11.2 SW10.4 ; port ROW_2
ROW3: R12.2 SW15.4 ; port ROW_3
ROW4: R13.2 SW20.4 ; port ROW_4
ROW5: R14.2 SW25.4 ; port ROW_5
NetD4_1: D4.1(C) D9.1(C) D14.1(C) D19.1(C) D24.1(C) ; port Column_1
NetD4_2: D4.2(A) SW1.1
NetD5_1: D5.1(C) D10.1(C) D15.1(C) D20.1(C) D25.1(C) ; port Column_2
NetD5_2: D5.2(A) SW2.1
NetD6_1: D6.1(C) D11.1(C) D16.1(C) D21.1(C) D26.1(C) ; port Column_3
NetD6_2: D6.2(A) SW3.1
NetD7_1: D7.1(C) D12.1(C) D17.1(C) D22.1(C) D27.1(C) ; port Column_4
NetD7_2: D7.2(A) SW4.1
NetD8_1: D8.1(C) D13.1(C) D18.1(C) D23.1(C) D28.1(C) ; port Column_5
NetD8_2: D8.2(A) SW5.1
NetD9_2: D9.2(A) SW6.1
NetD10_2: D10.2(A) SW7.1
NetD11_2: D11.2(A) SW8.1
NetD12_2: D12.2(A) SW9.1
NetD13_2: D13.2(A) SW10.1
NetD14_2: D14.2(A) SW11.1
NetD15_2: D15.2(A) SW12.1
NetD16_2: D16.2(A) SW13.1
NetD17_2: D17.2(A) SW14.1
NetD18_2: D18.2(A) SW15.1
NetD19_2: D19.2(A) SW16.1
NetD20_2: D20.2(A) SW17.1
NetD21_2: D21.2(A) SW18.1
NetD22_2: D22.2(A) SW19.1
NetD23_2: D23.2(A) SW20.1
NetD24_2: D24.2(A) SW21.1
NetD25_2: D25.2(A) SW22.1
NetD26_2: D26.2(A) SW23.1
NetD27_2: D27.2(A) SW24.1
NetD28_2: D28.2(A) SW25.1
NetSW1_4: SW1.4 SW2.3
NetSW2_4: SW2.4 SW3.3
NetSW3_4: SW3.4 SW4.3
NetSW4_4: SW4.4 SW5.3
NetSW6_4: SW6.4 SW7.3
NetSW7_4: SW7.4 SW8.3
NetSW8_4: SW8.4 SW9.3
NetSW9_4: SW9.4 SW10.3
NetSW11_4: SW11.4 SW12.3
NetSW12_4: SW12.4 SW13.3
NetSW13_4: SW13.4 SW14.3
NetSW14_4: SW14.4 SW15.3
NetSW16_4: SW16.4 SW17.3
NetSW17_4: SW17.4 SW18.3
NetSW18_4: SW18.4 SW19.3
NetSW19_4: SW19.4 SW20.3
NetSW21_4: SW21.4 SW22.3
NetSW22_4: SW22.4 SW23.3
NetSW23_4: SW23.4 SW24.3
NetSW24_4: SW24.4 SW25.3

Not connected (* = marked no-connect by the designer): SW1 2 3; SW2 2; SW3 2; SW4 2; SW5 2; SW6 2 3; SW7 2; SW8 2; SW9 2; SW10 2; SW11 2 3; SW12 2; SW13 2; SW14 2; SW15 2; SW16 2 3; SW17 2; SW18 2; SW19 2; SW20 2; SW21 2 3; SW22 2; SW23 2; SW24 2; SW25 2

### Library data of the parts
D4-D28 = CMP-15605-000006-1: as D2 on sheet GPRS; Max Operating Temperature: 175°C; Packaging: Tape and Reel; Radiation Hardening: No; Min Operating Temperature: -65°C; Reverse Recovery Time: 4ns; Mount: Surface Mount; RoHS Compliant: Yes; Max Forward Surge Current (Ifsm): 2A; Case/Package: SMD/SMT; Number of Pins: 2; Max Repetitive Reverse Voltage (Vrrm): 75V
R10-R14 = CMP-2100-03671-1: Chip Resistor, 1 KOhm, +/- 1%, 125 mW, -55 to 155 degC, 0805 (2012 Metric), RoHS, Tape and Reel; Manufacturer: Yageo; Temperature Coefficient: 100ppm/degreesC; Voltage Rating (DC): 150V; Max Power Dissipation: 125mW; Number of Pins: 2; Number of Terminations: 2; Datasheet URL: http://www.yageo.com/NewPortal/yageodocoutput?fileName=/pdf/R-Chip/PYu-RC_Group_51_RoHS_L_5.pdf; Length: 0.079inch; Package Description: 2-Pin Surface Mounted Device, Body 2 x 1.25 mm; Depth: 1.25mm; Height: 0.024inch; Military Standard: Not; Case/Package: 0805; Package Reference: 0805; RoHSCompliant: true; Lead Free: LeadFree; Packaging: TapeandReel; Package Quantity: 1; Datasheet Version: Rev. 5, 10/2016; Tolerance: 1%; Min Operating Temperature: -55degC; Voltage Rating: 150V; Composition: ThickFilm; Case Code (Imperial): 0805; Power Rating: 125mW; Width: 0.049inch; Case Code (Metric): 2012; Manufacturer URL: http://www.yageo.com/; Max Operating Temperature: 155degC; REACH SVHC: Unknown; Termination: SMD/SMT
SW1-SW25 = CMP-2000-05160-2: as BOOT1 on sheet MCU; Min Operating Temperature: -20°C; REACH SVHC: No SVHC; Termination: Gull Wing; Case/Package: SMD/SMT; Packaging: Tape and Reel; Mount: Surface Mount; Voltage Rating (DC): 12V; Orientation: Straight; Lead Free: Lead Free; Contact Material: Silver; Color: Black; Max Current Rating: 50mA; Contact Plating: Silver; Depth: 9mm; Package Quantity: 1; Max Voltage Rating (DC): 12V; Length: 6mm; Max Operating Temperature: 60°C

## Sheet GPS.SchDoc: Smart Bus Ticketing Machine/GPS
size A4; Date: 3/10/2025; ApprovedBy: Kiran Gunathilaka; CheckedBy: Kiran Gunathilaka; Author: Kiran Gunathilaka; DrawnBy: Kiran Gunathilaka; DocumentNumber: 04; Revision: v1.1; SheetNumber: 3; SheetTotal: 11
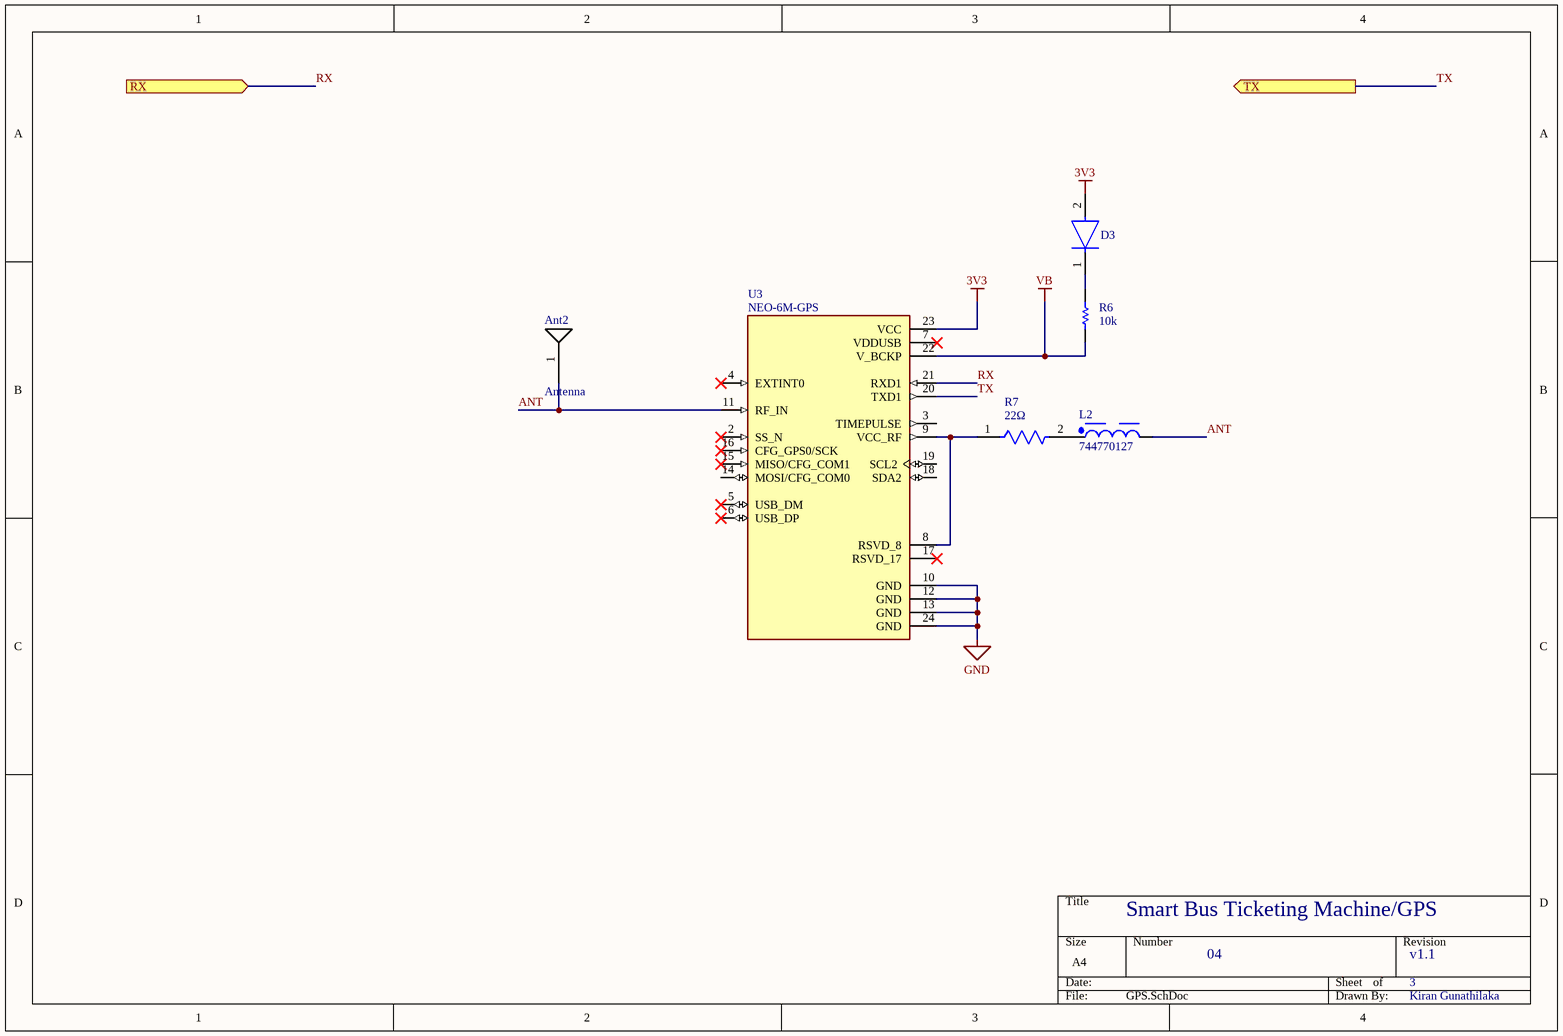
[diagram p5: GPS.SchDoc]

### Parts
Ant2  Antenna  [Antenna]
D3  TS4148 RYG  [FP-TS4148_RYG-MFG]  (value not drawn)
L2  744770127  [WE-PD_1280]
R6  value 10k  [RESC2013X60X35NL10T20]  (hidden comment: RC0805FR-0710KL)
R7  value 22Ω  [FP-CRGCQ0805-IPC_C]  (hidden comment: CRGCQ0805F22R)
U3  NEO-6M-GPS  [XCVR_NEO-6M-GPS]

### Ports
RX (in, see Main[2B]), TX (out, see Main[2B])

### Nets
3V3: D3.2(A) U3.23(VCC)
GND: U3.10(GND) U3.12(GND) U3.13(GND) U3.24(GND)
VB: R6.1 U3.22(V_BCKP)
ANT: Ant2.1 L2.2 U3.11(RF_IN)
RX: U3.21(RXD1) ; port RX  [project net GPS_TX]
TX: U3.20(TXD1) ; port TX  [project net GPS_RX]
NetD3_1: D3.1(C) R6.2
NetL2_1: L2.1 R7.2
NetR7_1: R7.1 U3.8(RSVD_8) U3.9(VCC_RF)

Not connected (* = marked no-connect by the designer): U3 2(SS_N)* 3(TIMEPULSE) 4(EXTINT0)* 5(USB_DM)* 6(USB_DP)* 7(VDDUSB)* 14(MOSI/CFG_COM0) 15(MISO/CFG_COM1)* 16(CFG_GPS0/SCK)* 17(RSVD_17)* 18(SDA2) 19(SCL2)

### Library data of the parts
D3 = CMP-15605-000006-1: as D2 on sheet GPRS; Max Operating Temperature: 175°C; Packaging: Tape and Reel; Radiation Hardening: No; Min Operating Temperature: -65°C; Reverse Recovery Time: 4ns; Mount: Surface Mount; RoHS Compliant: Yes; Max Forward Surge Current (Ifsm): 2A; Case/Package: SMD/SMT; Number of Pins: 2; Max Repetitive Reverse Voltage (Vrrm): 75V
L2 = CMP-0227-00199-2: NexarPartId: 22866873; Resistance: 46mΩ; Test Frequency: 1kHz; DC Resistance (DCR): 31mΩ; Max DC Current: 3.7A; Shielding: Shielded; Self Resonant Frequency: 10MHz; Core Material: Ferrite; Current Rating: 4.2A; Inductance: 27µH; Tolerance: 20%; Saturation Current: 3.8A; Height - Seated (Max): 8.001mm; Series Resistance: 46mΩ; Packaging: Cut Tape (CT); Height: 8mm; Number of Pins: 2; Length: 12mm; Depth: 12mm; REACH SVHC: Unknown; Lead Free: Lead Free; Composition: Wirewound; Case/Package: Nonstandard; Lead Pitch: 7mm; Termination: SMD/SMT; Min Operating Temperature: -40°C; Ambient Temperature Range High: 85°C; Max Operating Temperature: 125°C; Ambient Temperature Range Low: -40°C; Width: 12mm; RoHS: Compliant; RMS Current (Irms): 3.7A; Mount: Surface Mount; Inductance Tolerance: 20%
R6 = CMP-1659-00013-4: as R1 on sheet MCU; Mount: Surface Mount; ComponentLink1Description: Manufacturer URL; ComponentLink2URL: http://www.yageo.com/documents/recent/PYu-RC_Group_51_RoHS_L_04.pdf; Pins: 2; Length: 2 mm; Min Operating Temperature: -55 degC; Height: 0.5 mm; Mounting Technology: Surface Mount; RoHSCompliant: true; REACH SVHC: No SVHC; ComponentLink1URL: http://www.yageo.com/; Max Operating Temperature: 155 degC; PackageReference: 0805; DatasheetVersion: Rev. 4, 02/2016; Package Quantity: 5000; Packaging: Tape and Reel; ComponentLink2Description: Datasheet; PackageDescription: 2-Pin Surface Mounted Device, Body 2 x 1.25 mm
R7 = CMP-03211-006853-1: CRGCQ 0805 22R 1%; Manufacturer: TE Connectivity; Voltage Rating: 150V; Tolerance: 0.01; Power Rating: 0.125W; Automotive Grade: Grade 301; Temperature Coefficient: ±200ppm/°C; Temperature: -55°C to +155°C; Digikey Description: CRGCQ 0805 22R 1%; Ipc Land Pattern Name: RESC200125X55; Temperature Range Low: -55°C; ComponentLink2URL: https://www.te.com/commerce/DocumentDelivery/DDEController?Action=showdoc&DocId=Data+Sheet%7F1773204-3%7F1%7Fpdf%7FEnglish%7FENG_DS_1773204-3_1.pdf%7F4-2176341-310; Package: CRGCQ0805; Octopart: https://octopart.com/crgcq0805f22r-te+connectivity-91018162; Height: 0.65mm; Ambient Temperature Range High: +70°C; Resistance: 22Ω; Manufacturer Part Number: CRGCQ0805F22R; Device Class L2: Resistors; Composition: Thick Film; Temperature Range High: +155°C; Device Class L3: Chip SMD Resistors; RoHS: TRUE; Lead Free: Yes; Mouser Description: SMD AEC-Q200 Compliant Thick Film Chip Resistor; Device Class L1: Passive Components; ComponentLink2Description: Datasheet; Series: CRGCQ; Category: Res; Automotive: Yes
U3 = NEO-6M-GPS: GPS Development Tools SparkFun GNSS-RTK Dead Reckoning Breakout - ZED-F9K (Qwiic); MF: u-blox; SnapEDA_Link: https://www.snapeda.com/parts/NEO-6M-GPS/u-blox/view-part/?ref=snap; MP: NEO-6M-GPS; Availability: Not in stock; Price: None; Check_prices: https://www.snapeda.com/parts/NEO-6M-GPS/u-blox/view-part/?ref=eda; Value: *; Package: None

## Sheet PowerSupply.SchDoc: Smart Bus Ticketing Machine/Power Supply
size A4; Date: 3/10/2025; ApprovedBy: Kiran Gunathilaka; CheckedBy: Kiran Gunathilaka; Author: Kiran Gunathilaka; DrawnBy: Kiran Gunathilaka; DocumentNumber: 07; Revision: v1.2; SheetNumber: 7; SheetTotal: 11
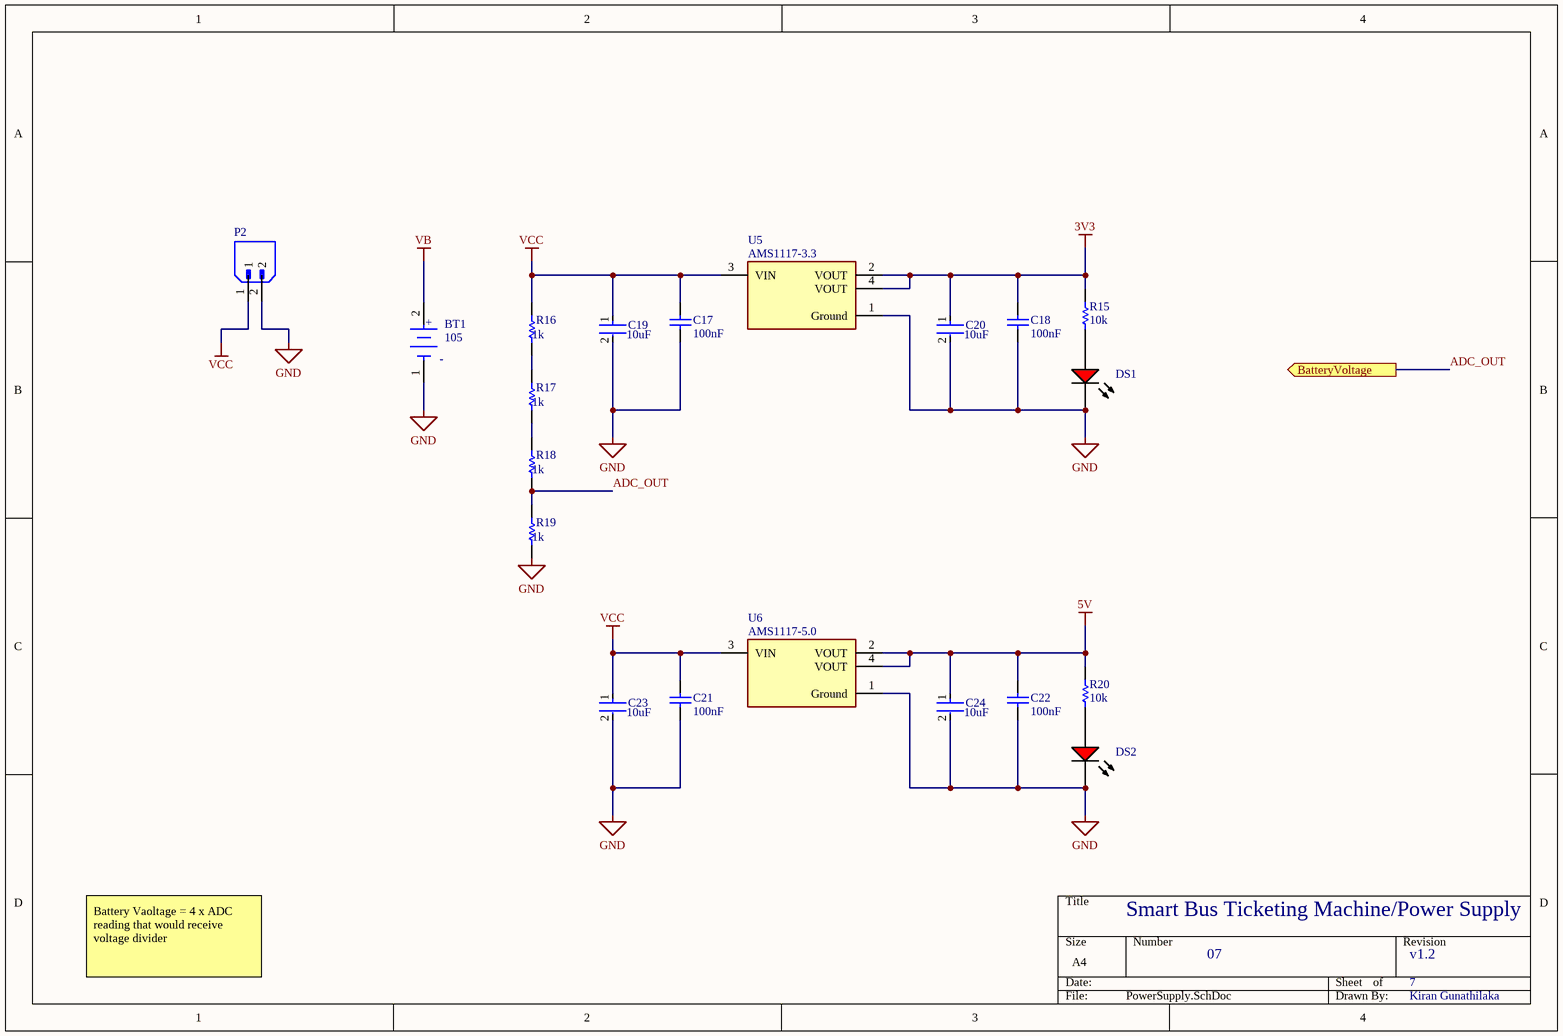
[diagram p6: PowerSupply.SchDoc]

### Parts
BT1  105  [FP-105-MFG]
C17  value 100nF  [CAPC2013X94X50ML20T25]  (hidden comment: 08051C152KAT2A)
C18  value 100nF  [CAPC2013X94X50ML20T25]  (hidden comment: 08051C152KAT2A)
C19  Capacitance: 10uF  [FP-C0805C106K9PACTU-MFG]  (hidden comment: C0805C106K9PACTU)
C20  Capacitance: 10uF  [FP-C0805C106K9PACTU-MFG]  (hidden comment: C0805C106K9PACTU)
C21  value 100nF  [CAPC2013X94X50ML20T25]  (hidden comment: 08051C152KAT2A)
C22  value 100nF  [CAPC2013X94X50ML20T25]  (hidden comment: 08051C152KAT2A)
C23  Capacitance: 10uF  [FP-C0805C106K9PACTU-MFG]  (hidden comment: C0805C106K9PACTU)
C24  Capacitance: 10uF  [FP-C0805C106K9PACTU-MFG]  (hidden comment: C0805C106K9PACTU)
DS1  HSMH-C150  [AVAG-HSMX-C150_V]  (value not drawn)
DS2  HSMH-C150  [AVAG-HSMX-C150_V]  (value not drawn)
P2  Battery Connector  [JST_B2B-XH-A(LF)(SN)]  (value not drawn)
R15  value 10k  [RESC2013X60X35NL10T20]  (hidden comment: RC0805FR-0710KL)
R16  Resistance: 1k  [RESC2013X60X35ML10T20]  (hidden comment: RC0805FR-071KL)
R17  Resistance: 1k  [RESC2013X60X35ML10T20]  (hidden comment: RC0805FR-071KL)
R18  Resistance: 1k  [RESC2013X60X35ML10T20]  (hidden comment: RC0805FR-071KL)
R19  Resistance: 1k  [RESC2013X60X35ML10T20]  (hidden comment: RC0805FR-071KL)
R20  value 10k  [RESC2013X60X35NL10T20]  (hidden comment: RC0805FR-0710KL)
U5  AMS1117-3.3  [FP-AMS1117-IPC_C]
U6  AMS1117-5.0  [FP-AMS1117-IPC_C]

### Ports
BatteryVoltage (out, see Main[1A])

### Nets
3V3: C18.2 C20.1 R15.1 U5.2(VOUT) U5.4(VOUT)
5V: C22.2 C24.1 R20.1 U6.2(VOUT) U6.4(VOUT)
GND: BT1.1(-) C17.1 C18.1 C19.2 C20.2 C21.1 C22.1 C23.2 C24.2 DS1.2(K) DS2.2(K) P2.2 R19.1 U5.1(Ground) U6.1(Ground)
VB: BT1.2(+)
VCC: C17.2 C19.1 C21.2 C23.1 P2.1 R16.2 U5.3(VIN) U6.3(VIN)
ADC_OUT: R18.1 R19.2 ; port BatteryVoltage
NetDS1_1: DS1.1(A) R15.2
NetDS2_1: DS2.1(A) R20.2
NetR16_1: R16.1 R17.2
NetR17_1: R17.1 R18.2

### Notes on the sheet
- Battery Vaoltage = 4 x ADC reading that would receive voltage divider

### Library data of the parts
BT1 = CMP-00214-00028800-1: 105 Battery Holder Coin Cell 1 Cell PC Pin PCB Through Hole Mount PBT 0.944 in. Dia; NexarPartId: 28800; Number of Contacts: 2; Number of Batteries: 1; Approvals: UL; Wire/Cable Gauge: 1AWG; Body Material: Glass, Nylon, PBT; Material: Plastic, Steel; REACH SVHC: No SVHC; Min Operating Temperature: -50°C; Lead Free: Lead Free; Height: 8.75mm; Diameter: 24mm; Termination: PC Pin; Max Operating Temperature: 145°C; Contact Material: Nickel; Number of Cells: 1; Packaging: Bulk; Contact Plating: Nickel; Mount: PCB, Through Hole; RoHS: Compliant
C17 C18 C21 C22 = CMP-2007-04179-1: Manufacturer: AVX Interconnect / Elco; Part Number: 08051C152KAT2A
C19 C20 C23 C24 = CMP-03020-034676-1: CAP CER 10UF 6.3V X5R 0805; Dielectric Material: Ceramic; Dissipation Factor: 5%; Tolerance: 10%; Thickness: 0.055inch; Mount: Surface Mount; Voltage: 6.3V; Case Code (Imperial): 0805; Lead Pitch: 0.75mm; Height: 1.25mm; Construction: Flat; Number of Pins: 2; Contact Material: Tin; Case/Package: 0805; Case Code (Metric): 2012; Termination: SMD/SMT; Width: 1.2mm; Dielectric: X5R; Lead Free: Lead Free; Min Operating Temperature: -55°C; Voltage Rating (DC): 6.3V; Series: C; Packaging: Tape and Reel; Radiation Hardening: No; Length: 2mm; REACH SVHC: No SVHC; RoHS Compliant: Yes; Max Operating Temperature: 85°C; Package Quantity: 1; Voltage Rating: 6.3V; Depth: 1.25mm
DS1 DS2 = CMP-2000-06426-1: LED Uni-Color Red, 65 mW, 25 mA, -40 to 85 degC, 2-Pin SMD, RoHS, Tape and Reel; Manufacturer: Avago; Product Height (mm): 1.1mm; Power Dissipation: 78W; Product Length (mm): 3.2mm; Forward Voltage: 2.6V; Luminous Intensity: 17mcd; DELETED: Compliant; Shape Type: Rectangular; Peak Wavelength: 660nm; Main Category: ChipLED; Dominant Wave Length: 639nm; Rad Hardened: No; Lens Type: ColorlessDiffused; Product Depth (mm): 1.6mm; Reverse Voltage: 5V; Forward Current: 25mA; Chip Material: GaAlAs; Test Current (It): 20mA; Viewing Angle: 170deg; Number of  Elements: 1; Type: Uni-Color; Package Reference: HSMX-C150; Package Description: 2-Pin Surface Mount Device, Body 3.2 x 1.6 mm; Operating Temp Range: -40Cto85C; Mounting: SurfaceMount; Emitting Color: Red; Pin Count: 2; Operating Temperature Classification: Industrial; Datasheet URL: http://media.digikey.com/pdf/Data%20Sheets/Avago%20PDFs/HSMz-Czzz.pdf; Package Type: ChipLed; Mounting Technology: SurfaceMount; High Brightness: No; Lens Dimensions: 2x1.6x0.6mm; Manufacturer URL: http://www.avagotech.com/; Lum Intensity: 17mcd; Datasheet Version: 03/2012; Packaging: TapeandReel
P2 = TX_RX Header
R15 R20 = CMP-1659-00013-4: as R1 on sheet MCU; Mount: Surface Mount; ComponentLink1Description: Manufacturer URL; ComponentLink2URL: http://www.yageo.com/documents/recent/PYu-RC_Group_51_RoHS_L_04.pdf; Pins: 2; Length: 2 mm; Min Operating Temperature: -55 degC; Height: 0.5 mm; Mounting Technology: Surface Mount; RoHSCompliant: true; REACH SVHC: No SVHC; ComponentLink1URL: http://www.yageo.com/; Max Operating Temperature: 155 degC; PackageReference: 0805; DatasheetVersion: Rev. 4, 02/2016; Package Quantity: 5000; Packaging: Tape and Reel; ComponentLink2Description: Datasheet; PackageDescription: 2-Pin Surface Mounted Device, Body 2 x 1.25 mm
R16-R19 = CMP-2100-03671-1: as R10 on sheet Keyboard; Number of Pins: 2; Number of Terminations: 2; Datasheet URL: http://www.yageo.com/NewPortal/yageodocoutput?fileName=/pdf/R-Chip/PYu-RC_Group_51_RoHS_L_5.pdf; Length: 0.079inch; Package Description: 2-Pin Surface Mounted Device, Body 2 x 1.25 mm; Depth: 1.25mm; Height: 0.024inch; Military Standard: Not; Case/Package: 0805; Package Reference: 0805; RoHSCompliant: true; Lead Free: LeadFree; Packaging: TapeandReel; Package Quantity: 1; Datasheet Version: Rev. 5, 10/2016; Tolerance: 1%; Min Operating Temperature: -55degC; Voltage Rating: 150V; Composition: ThickFilm; Case Code (Imperial): 0805; Power Rating: 125mW; Width: 0.049inch; Case Code (Metric): 2012; Manufacturer URL: http://www.yageo.com/; Max Operating Temperature: 155degC; REACH SVHC: Unknown; Termination: SMD/SMT
U5 = CMP-209535-000001-1: LDO Voltage Regulators 1A, 3.3V; Manufacturer: Advanced Monolithic Systems; Dropout Voltage: 1.1V; Output Type: Fixed; Nominal Supply Current: 5mA; Max Power Dissipation: 1.2W; Max Supply Voltage: 15V; Number Of Outputs: 1; Standoff Height: 0.64mm; Max Junction Temp: +125°C; Height: 1.8mm; Package: AMS1117; Device Class L2: Power Management ICs; ComponentLink2Description: Datasheet; ComponentLink2URL: http://www.advanced-monolithic.com/pdf/ds1117.pdf; Category: IC; RoHS: TRUE; Automotive: No; Device Class L1: Integrated Circuits (ICs); Output Current: 1A; Device Class L3: Voltage Regulators - Linear; Temperature: -40°C to +125°C; Output Voltage: 3.3V; Manufacturer Part Number: AMS1117-3.3; Temperature Range Low: -40°C; Octopart: https://octopart.com/ams1117-3.3-advanced+monolithic+systems-25899300; Lead Free: Yes; Ipc Land Pattern Name: SOT229P700X180-4; Temperature Range High: +125°C
U6 = CMP-209535-000001-1: LDO Voltage Regulators 1A, 3.3V; Manufacturer Part Number: AMS1117-3.3; Manufacturer: Advanced Monolithic Systems; Dropout Voltage: 1.1V; Output Type: Fixed; Nominal Supply Current: 5mA; Max Power Dissipation: 1.2W; Max Supply Voltage: 15V; Number Of Outputs: 1; Standoff Height: 0.64mm; Max Junction Temp: +125°C; Height: 1.8mm; Package: AMS1117; Device Class L2: Power Management ICs; ComponentLink2Description: Datasheet; ComponentLink2URL: http://www.advanced-monolithic.com/pdf/ds1117.pdf; Category: IC; RoHS: TRUE; Automotive: No; Device Class L1: Integrated Circuits (ICs); Output Current: 1A; Device Class L3: Voltage Regulators - Linear; Temperature: -40°C to +125°C; Output Voltage: 3.3V; Temperature Range Low: -40°C; Octopart: https://octopart.com/ams1117-3.3-advanced+monolithic+systems-25899300; Lead Free: Yes; Ipc Land Pattern Name: SOT229P700X180-4; Temperature Range High: +125°C

## Sheet Outputs.SchDoc: Smart Bus Ticketing Machine/Outputs
size A4; Date: 3/10/2025; ApprovedBy: Kiran Gunathilaka; CheckedBy: Kiran Gunathilaka; Author: Kiran Gunathilaka; DrawnBy: Kiran Gunathilaka; Engineer: Kiran Gunathilaka; DocumentNumber: 08; Revision: v1.2; SheetNumber: 8; SheetTotal: 11
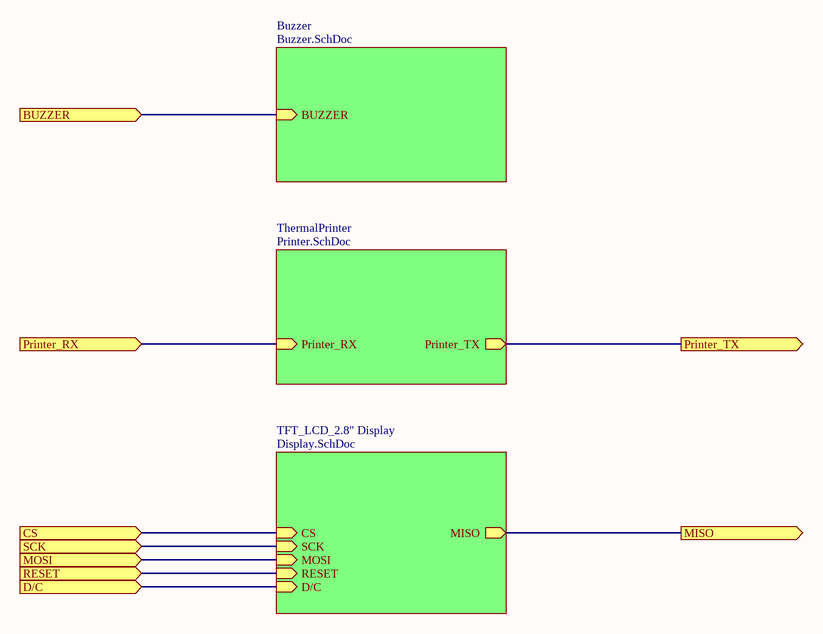
[diagram p7: Outputs.SchDoc]

### Sub-sheets
Buzzer = Buzzer.SchDoc: BUZZER (in)
TFT_LCD_2.8" Display = Display.SchDoc: CS (in), SCK (in), MOSI (in), RESET (in), D/C (in), MISO (out)
ThermalPrinter = Printer.SchDoc: Printer_TX (out), Printer_RX (in)

### Ports
BUZZER (in, see Main[3B], Buzzer[2B], MCU[4A]), CS (in, see Main[3C], Display[2C], MCU[4A]), D/C (in, see Main[3C], Display[2C], MCU[4A]), MISO (out, see Main[3B], Display[3B], MCU[1A]), MOSI (in, see Main[3C], Display[2C], MCU[4A]), Printer_RX (in, see Main[3B], Printer[2B]), Printer_TX (out, see Main[3B], Printer[3B]), RESET (in, see Main[3C], Display[2C], MCU[4A]), SCK (in, see Main[3B], Display[2C], MCU[4A])

### Nets
Buzzer: port BUZZER, sheet Buzzer/BUZZER
CS: port CS, sheet TFT_LCD_2.8" Display/CS
D/C: port RESET, sheet TFT_LCD_2.8" Display/RESET
MISO: port MISO, sheet TFT_LCD_2.8" Display/MISO
MOSI: port MOSI, sheet TFT_LCD_2.8" Display/MOSI
Printer_RX: port Printer_TX, sheet ThermalPrinter/Printer_TX
Printer_TX: port Printer_RX, sheet ThermalPrinter/Printer_RX
RESET: port D/C, sheet TFT_LCD_2.8" Display/D/C
SCK: port SCK, sheet TFT_LCD_2.8" Display/SCK

## Sheet Buzzer.SchDoc: Smart Bus Ticketing Machine/Outputs/Buzzer
size A; ApprovedBy: Kiran Gunathilaka; CheckedBy: Kiran Gunathilaka; Author: Kiran Gunathilaka; CompanyName: Kiran Gunathilaka; DrawnBy: Kiran Gunathilaka; Engineer: Kiran Gunathilaka; DocumentNumber: 09; Revision: v1.2; SheetNumber: 9; SheetTotal: 11
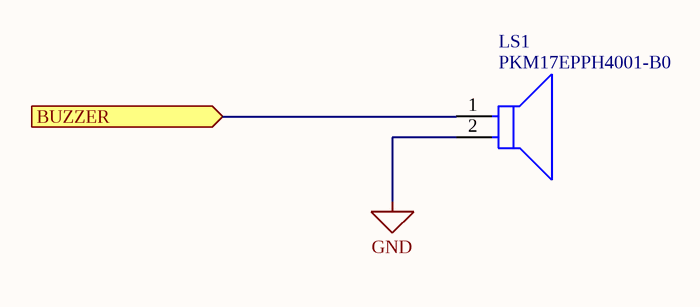
[diagram p8: Buzzer.SchDoc]

### Parts
LS1  PKM17EPPH4001-B0  [FP-PKM17EPPH4001-B0-MFG]

### Ports
BUZZER (in, see Outputs[3B], MCU[4A], Outputs[2B])

### Nets
GND: LS1.2
Buzzer: LS1.1 ; port BUZZER

### Library data of the parts
LS1 = CMP-06202-000027-1: AUDIO PIEZO TRANSDUCER 25V TH; Capacitance: 7nF; Self Resonant Frequency: 4kHz; Voltage Rating: 3V; Washable: No; Package Quantity: 600; Height: 7mm; Radiation Hardening: No; Lead Free: Lead Free; Max Operating Temperature: 70°C; REACH SVHC: No SVHC; Packaging: Bulk; Min Operating Temperature: -20°C; Diameter: 17mm; Voltage Rating (DC): 25V; Max Frequency: 4kHz; Nominal Input Voltage: 3V; Mount: Through Hole; Max Supply Voltage: 25V; Frequency: 4kHz; Termination: Solder

## Sheet Printer.SchDoc: Smart Bus Ticketing Machine/Outputs/Printer
size A; ApprovedBy: Kiran Gunathilaka; CheckedBy: Kiran Gunathilaka; Author: Kiran Gunathilaka; DrawnBy: Kiran Gunathilaka; Engineer: Kiran Gunathilaka; DocumentNumber: 10; Revision: v1.2; SheetNumber: 10; SheetTotal: 11
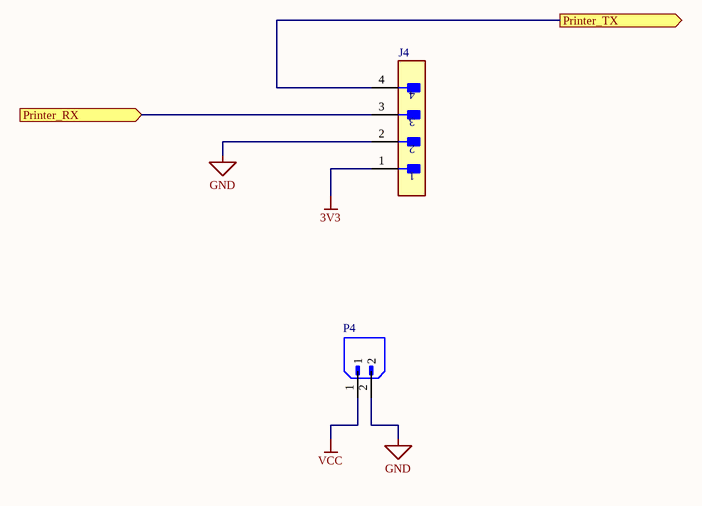
[diagram p9: Printer.SchDoc]

### Parts
J4  B04B-XASK-1(LF)(SN)  [FP-B04B-XASK-1_LF_SN-MFG]  (value not drawn)
P4  Battery Connector  [JST_B2B-XH-A(LF)(SN)]  (value not drawn)

### Ports
Printer_RX (in, see Outputs[3C], Outputs[2C]), Printer_TX (out, see Outputs[3C], Outputs[4C])

### Nets
3V3: J4.1
GND: J4.2 P4.2
VCC: P4.1
Printer_RX: J4.4 ; port Printer_TX
Printer_TX: J4.3 ; port Printer_RX

### Library data of the parts
J4 = CMP-17439-000018-1: as J3 on sheet MCU; ComponentLink2Description: Datasheet; Package: B04B-XASK-1(LF)(SN); Octopart: https://octopart.com/b04b-xask-1%28lf%29%28sn%29-jst-3990149; Pitch: 2.5mm; Device Class L1: Connectors; RoHS: TRUE; Device Class L3: unset; Manufacturer Part Number: B04B-XASK-1(LF)(SN); Temperature Range High: +85°C; Height: 8.8mm; Lead Free: Yes; Category: Conn; Temperature: -25°C to +85°C; Digikey Description: CONN HEADER VERT 4POS 2.5MM; Temperature Range Low: -25°C; ComponentLink2URL: http://www.jst-mfg.com/product/pdf/eng/eXA1.pdf; Contact Material: Tin,Copper; Device Class L2: Headers and Wire Housings; Automotive: No; Number Of Rows: 1
P4 = TX_RX Header

## Sheet Display.SchDoc: Smart Bus Ticketing Machine/Outputs/Display
size A; ApprovedBy: Kiran Gunathilaka; CheckedBy: Kiran Gunathilaka; Author: Kiran Gunathilaka; DrawnBy: Kiran Gunathilaka; Engineer: Kiran Gunathilaka; DocumentNumber: 11; Revision: v1.2; SheetNumber: 11; SheetTotal: 11
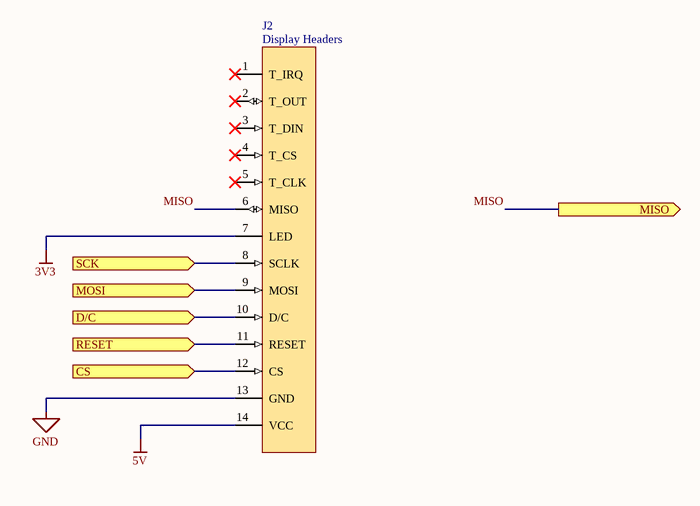
[diagram p10: Display.SchDoc]

### Parts
J2  Display Headers  [Display Without Cutouts]

### Ports
CS (in, see Outputs[3C], MCU[4A], Outputs[2C]), D/C (in, see Outputs[3D], MCU[4A], Outputs[2D]), MISO (out, see Outputs[3C], MCU[1A], Outputs[4C]), MOSI (in, see Outputs[3D], MCU[4A], Outputs[2D]), RESET (in, see Outputs[3D], MCU[4A], Outputs[2D]), SCK (in, see Outputs[3C], MCU[4A], Outputs[2C])

### Nets
3V3: J2.7(LED)
5V: J2.14(VCC)
GND: J2.13(GND)
CS: J2.12(CS) ; port CS
D/C: J2.11(RESET) ; port RESET
MISO: J2.6(MISO) ; port MISO
MOSI: J2.9(MOSI) ; port MOSI
RESET: J2.10(D/C) ; port D/C
SCK: J2.8(SCLK) ; port SCK

Not connected (* = marked no-connect by the designer): J2 1(T_IRQ)* 2(T_OUT)* 3(T_DIN)* 4(T_CS)* 5(T_CLK)*

### Library data of the parts
J2 = TFT-LCD-2.8'' Display Headers

## Nets that join several sheets
3V3: MCU (13 pins), GPRS (U2.2 U2.3), IMU (6 pins), GPS (D3.2 U3.23), PowerSupply (5 pins), Printer (J4.1), Display (J2.7)
5V: PowerSupply (5 pins), Display (J2.14)
GND: MCU (21 pins), GPRS (7 pins), IMU (7 pins), Keyboard (5 pins), GPS (U3.10 U3.12 U3.13 U3.24), PowerSupply (15 pins), Buzzer (LS1.2), Printer (J4.2 P4.2), Display (J2.13)
VB: MCU (D1.2), GPS (R6.1 U3.22), PowerSupply (BT1.2)
VCC: PowerSupply (8 pins), Printer (P4.1)
ADC_OUT: MCU (U1.11), PowerSupply (R18.1 R19.2)
BOOT: MCU (U1.29), GPRS (U2.19)
Buzzer: MCU (U1.38), Buzzer (LS1.1)
CS: MCU (U1.14), Display (J2.12)
D/C: MCU (U1.31), Display (J2.11)
GPRS_RX: MCU (U1.39), GPRS (R4.1)
GPRS_TX: MCU (U1.42), GPRS (D2.1)
GPS_RX: MCU (U1.33), GPS (U3.20)
GPS_TX: MCU (U1.32), GPS (U3.21)
MISO: MCU (U1.16), Display (J2.6)
MOSI: MCU (U1.17), Display (J2.9)
NetD4_1: MCU (U1.21), Keyboard (5 pins)
NetD5_1: MCU (U1.25), Keyboard (5 pins)
NetD6_1: MCU (U1.26), Keyboard (5 pins)
NetD7_1: MCU (U1.27), Keyboard (5 pins)
NetD8_1: MCU (U1.28), Keyboard (5 pins)
NetR8_2: MCU (U1.45), IMU (R8.2 U4.23)
NetR9_2: MCU (U1.46), IMU (R9.2 U4.24)
Printer_RX: MCU (U1.13), Printer (J4.4)
Printer_TX: MCU (U1.12), Printer (J4.3)
RESET: MCU (U1.30), Display (J2.10)
ROW1: MCU (U1.18), Keyboard (R10.2 SW5.4)
ROW2: MCU (U1.19), Keyboard (R11.2 SW10.4)
ROW3: MCU (U1.40), Keyboard (R12.2 SW15.4)
ROW4: MCU (U1.41), Keyboard (R13.2 SW20.4)
ROW5: MCU (U1.43), Keyboard (R14.2 SW25.4)
SCK: MCU (U1.15), Display (J2.8)